# EAGLE design MKRFox1200V2.0 (EAGLE 7.7.0)
Assembly variants: Chip Antenna, Antenna Connector

## Sheet 1 of 2
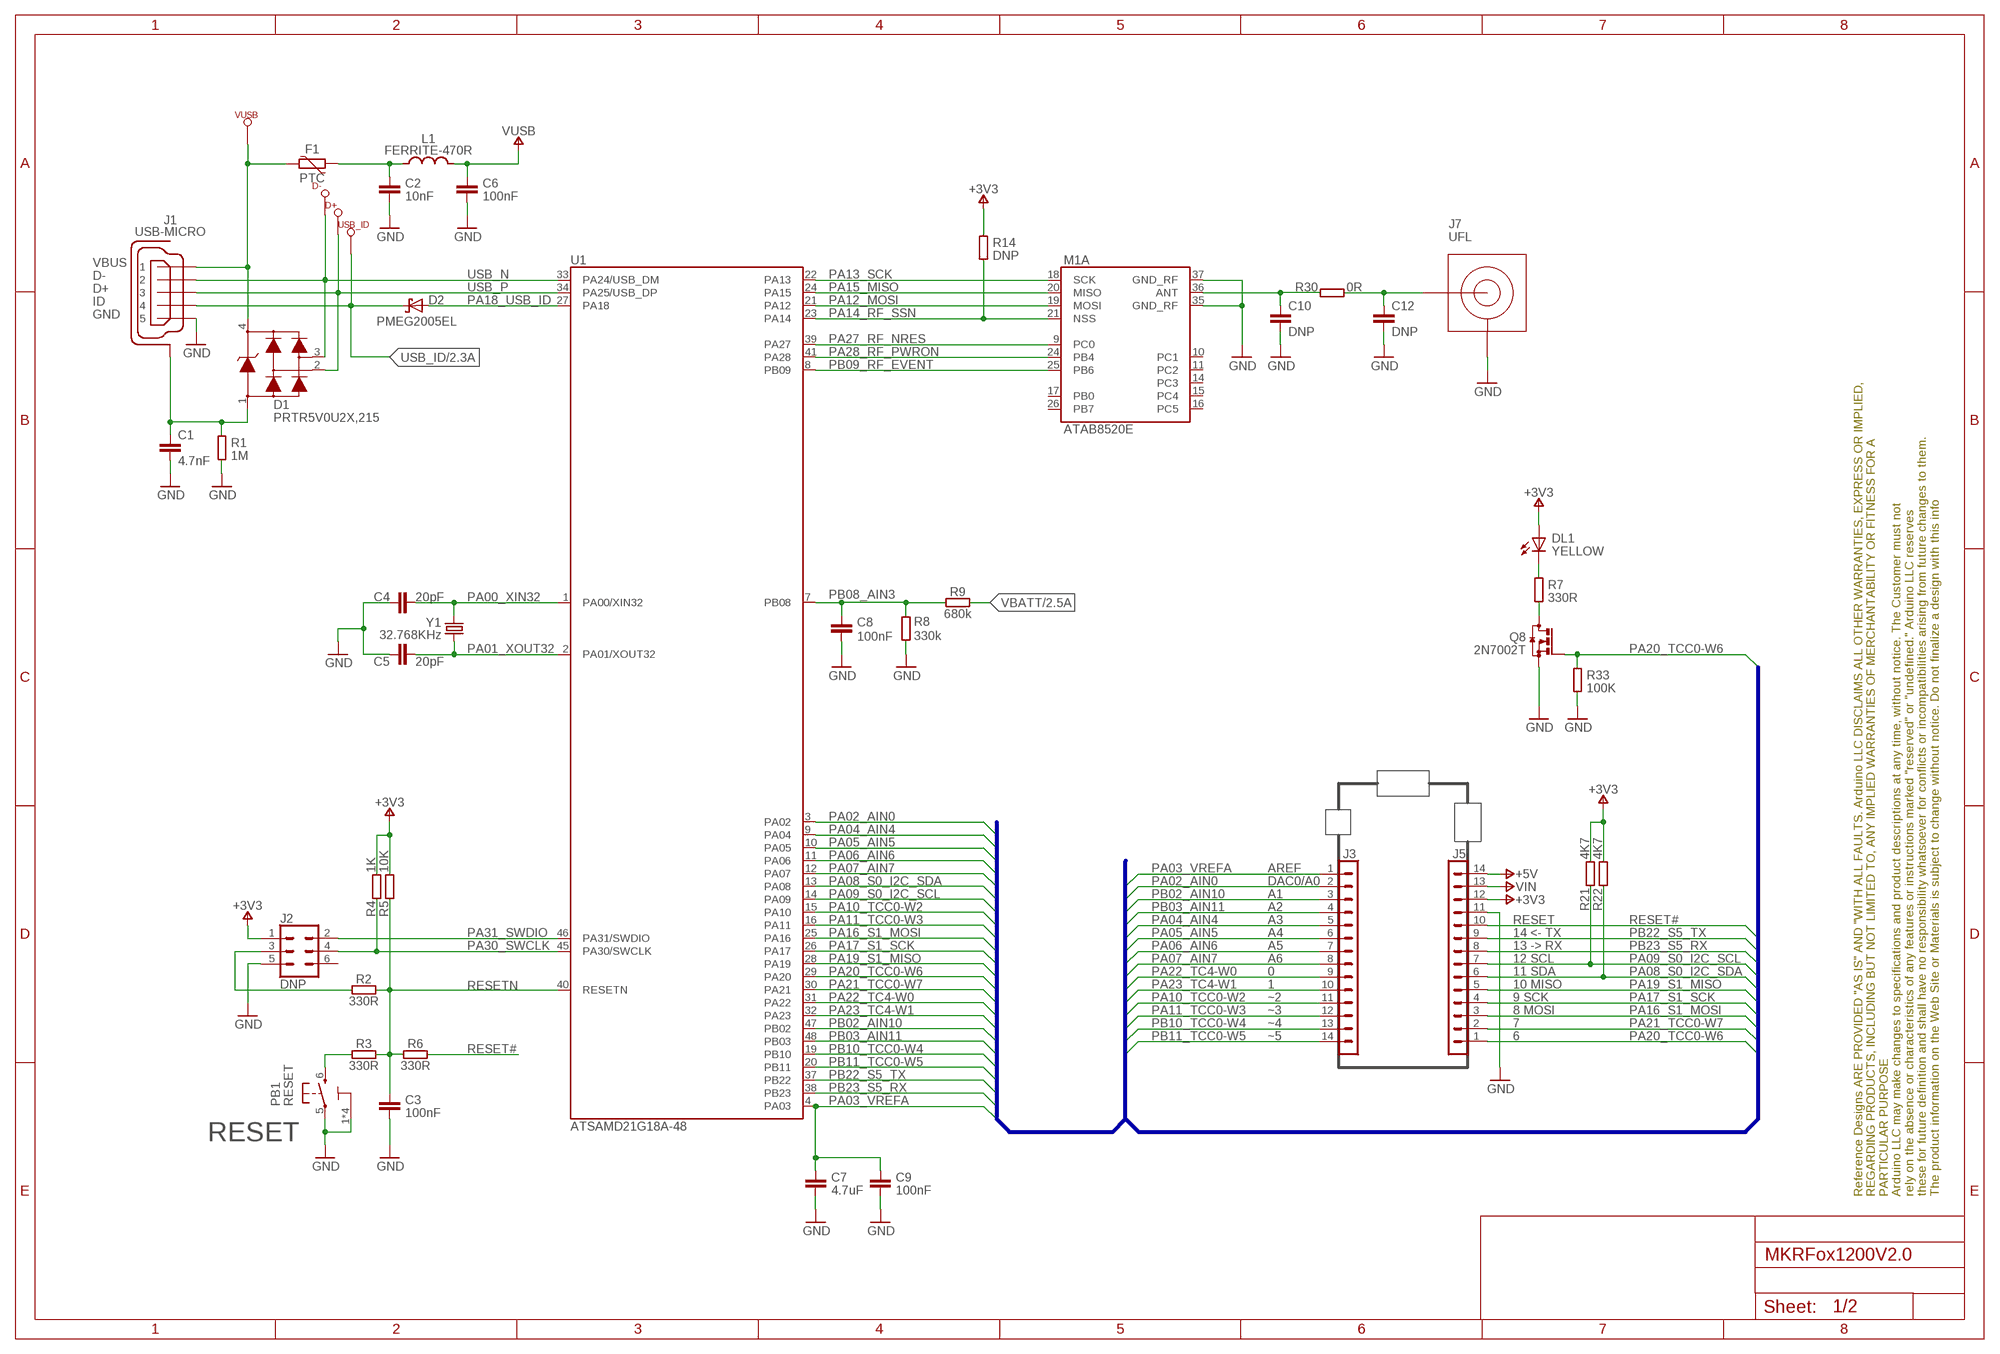
[diagram p0: schematic, sheet 1]

### Parts
C1  4.7nF  C4.7NF-0805  [0805-R2013X50N]
C2  10nF  C-10NF-0402  [0402-1005X55N]
C3  100nF  C-100NF-0402  [0402-1005X55N]
C4  20pF  C-20PF-0402  [0402-1005X55N]
C5  20pF  C-20PF-0402  [0402-1005X55N]
C6  100nF  C-100NF-0402  [0402-1005X55N]
C7  4.7uF  C-4.7UF-0402  [0402-1005X55N]
C8  100nF  C-100NF-0402  [0402-1005X55N]
C9  100nF  C-100NF-0402  [0402-1005X55N]
C10  DNP  CDNP-0402  [0402-1005X55N]
C12  DNP  CDNP-0402  [0402-1005X55N]
D1  PRTR5V0U2X,215  [SOT190P230X110-4N]
D2  PMEG2005EL  [SODFL1008X40N-882D]
D+  TP1.00MM  [TP-1.00MM]
D-  TP1.00MM  [TP-1.00MM]
DL1  YELLOW  LED-YELLOW-0603  [LEDC1608X80N-AK]
F1  PTC  [0603-1608X90N]
FRAME1  Page 1  A3L-LOC  [FRAME]
J1  USB-MICRO  [ZX62-AB-5PA]
J2  DNP  2X3_SMD_MALE  [2X3_SMT]
J3  DNP  PINHD-1X14-SMTH-SMD  [1X14_SMD_TH]
J5  DNP  PINHD-1X14-SMTH-SMD  [1X14_SMD_TH]
J7  UFL  [U.FL-R-SMT-1(60)]
L1  FERRITE-470R  [0603-1608X90N@1]
M1  ATAB8520E  [ATAB8520E]
PB1  RESET  TACTILE1  [C&K_PTS820_NO_HOLES]
Q8  2N7002T  [SOTFL50P160X78-3]
R1  1M  R-1M-0402  [0402-1005X55N]
R2  330R  R-330R-0402  [0402-1005X55N]
R3  330R  R-330R-0402  [0402-1005X55N]
R4  1K  R-10K-0402  [0402-1005X55N]
R5  10K  R-10K-0402  [0402-1005X55N]
R6  330R  R-330R-0402  [0402-1005X55N]
R7  330R  R-330R-0402  [0402-1005X55N]
R8  330k  R-330K-0402  [0402-1005X55N]
R9  680k  R-680K-0402  [0402-1005X55N]
R14  DNP  R-DNP-0402  [0402-1005X55N]
R21  4K7  R-4K7-0402  [0402-1005X55N]
R22  4K7  R-4K7-0402  [0402-1005X55N]
R30  0R  R-0R-0402  [0402-1005X55N]
R33  100K  R-100K-0402  [0402-1005X55N]
U1  ATSAMD21G18A-48  [QFN50P700X700X90-49XN-EPSQ515]
USB_ID  TP1.00MM  [TP-1.00MM]
VUSB  TP1.00MM  [TP-1.00MM]
Y1  32.768KHz  32.768KHZ  [ABS07]

### Nets
+3V3: DL1.A J2.1 J5.12 R4.2 R5.2 R14.2 R21.2 R22.2 ; also sheet 2
+5V: J5.14 ; also sheet 2
GND: C1.2 C2.2 C3.2 C4.1 C5.1 C6.2 C7.2 C8.2 C9.2 C10.2 C12.2 J1.5 J2.5 J5.11 J7.GND1(GND) J7.GND2(GND) M1.35(A:GND_RF) M1.37(A:GND_RF) PB1.1 PB1.2 PB1.3 PB1.4 PB1.5 Q8.S R1.1 R8.1 R33.1 ; also sheet 2
N17650912: D1.4 F1.2 J1.1 VUSB.X(TESTP)
N17658775: PB1.6 R3.1
N$1: C1.1 D1.1 J1.6(SH) J1.7(SH) J1.8(SH) J1.9(SH) J1.10(SH) J1.11(SH) R1.2
N$2: C2.1 F1.1 L1.1
N$3: DL1.C R7.2
N$4: J2.3 R2.1
N$6: Q8.D R7.1
N$17: C12.1 J7.SIG R30.2
N$38: C10.1 M1.36(A:ANT) R30.1
PA00_XIN32: C4.2 U1.1(PA00/XIN32) Y1.2
PA01_XOUT32: C5.2 U1.2(PA01/XOUT32) Y1.1
PA02_AIN0: J3.2 U1.3(PA02)
PA03_VREFA: C7.1 C9.1 J3.1 U1.4(PA03)
PA04_AIN4: J3.5 U1.9(PA04)
PA05_AIN5: J3.6 U1.10(PA05)
PA06_AIN6: J3.7 U1.11(PA06)
PA07_AIN7: J3.8 U1.12(PA07)
PA08_S0_I2C_SDA: J5.6 R22.1 U1.13(PA08)
PA09_S0_I2C_SCL: J5.7 R21.1 U1.14(PA09)
PA10_TCC0-W2: J3.11 U1.15(PA10)
PA11_TCC0-W3: J3.12 U1.16(PA11)
PA12_MOSI: M1.19(A:MOSI) U1.21(PA12)
PA13_SCK: M1.18(A:SCK) U1.22(PA13)
PA14_RF_SSN: M1.21(A:NSS) R14.1 U1.23(PA14)
PA15_MISO: M1.20(A:MISO) U1.24(PA15)
PA16_S1_MOSI: J5.3 U1.25(PA16)
PA17_S1_SCK: J5.4 U1.26(PA17)
PA18_USB_ID: D2.A U1.27(PA18)
PA19_S1_MISO: J5.5 U1.28(PA19)
PA20_TCC0-W6: J5.1 Q8.G R33.2 U1.29(PA20)
PA21_TCC0-W7: J5.2 U1.30(PA21)
PA22_TC4-W0: J3.9 U1.31(PA22)
PA23_TC4-W1: J3.10 U1.32(PA23)
PA27_RF_NRES: M1.9(A:PC0) U1.39(PA27)
PA28_RF_PWRON: M1.24(A:PB4) U1.41(PA28)
PA30_SWCLK: J2.4 R4.1 U1.45(PA30/SWCLK)
PA31_SWDIO: J2.2 U1.46(PA31/SWDIO)
PB02_AIN10: J3.3 U1.47(PB02)
PB03_AIN11: J3.4 U1.48(PB03)
PB08_AIN3: C8.1 R8.2 R9.1 U1.7(PB08)
PB09_RF_EVENT: M1.25(A:PB6) U1.8(PB09)
PB10_TCC0-W4: J3.13 U1.19(PB10)
PB11_TCC0-W5: J3.14 U1.20(PB11)
PB22_S5_TX: J5.9 U1.37(PB22)
PB23_S5_RX: J5.8 U1.38(PB23)
RESET#: J5.10 R6.2
RESETN: C3.1 R2.2 R3.2 R5.1 R6.1 U1.40(RESETN)
USB_ID: D2.C J1.4 USB_ID.X(TESTP) ; also sheet 2
USB_N: D1.3 D-.X(TESTP) J1.2 U1.33(PA24/USB_DM)
USB_P: D1.2 D+.X(TESTP) J1.3 U1.34(PA25/USB_DP)
VBATT: R9.2 ; also sheet 2
VIN: J5.13 ; also sheet 2
VUSB: C6.1 L1.2 ; also sheet 2
Unconnected: J2.6 M1.10(A:PC1) M1.11(A:PC2) M1.14(A:PC3) M1.15(A:PC4) M1.16(A:PC5) M1.17(A:PB0) M1.26(A:PB7)

### Buses
PA03_VREFA,PA02_AIN0,PB02_AIN10,PB03_AIN11,PA04_AIN4,PA05_AIN5,PA06_AIN6,PA07_AIN7,PA22_TC4-W0,PA23_TC4-W1,PA10_TCC0-W2,PA11_TCC0-W3,PB10_TCC0-W4,PB11_TCC0-W5,PA20_TCC0-W6,PA21_TCC0-W7,PA16_S1_MOSI,PA17_S1_SCK,PA19_S1_MISO,PA08_S0_I2C_SDA,PA09_S0_I2C_SCL,PB23_S5_RX,PB22_S5_TX,RESET#

### Notes on the sheet
- AREF
- DAC0/A0
- A1
- A2
- A3 | RESET
- A4 | 14 <- TX
- A5 | 13 -> RX
- A6 | 12 SCL
- 0 | 11 SDA
- 1 | 10 MISO
- ~2 | 9 SCK
- ~3 | 8 MOSI
- ~4 | 7
- ~5 | 6
- RESET

## Sheet 2 of 2
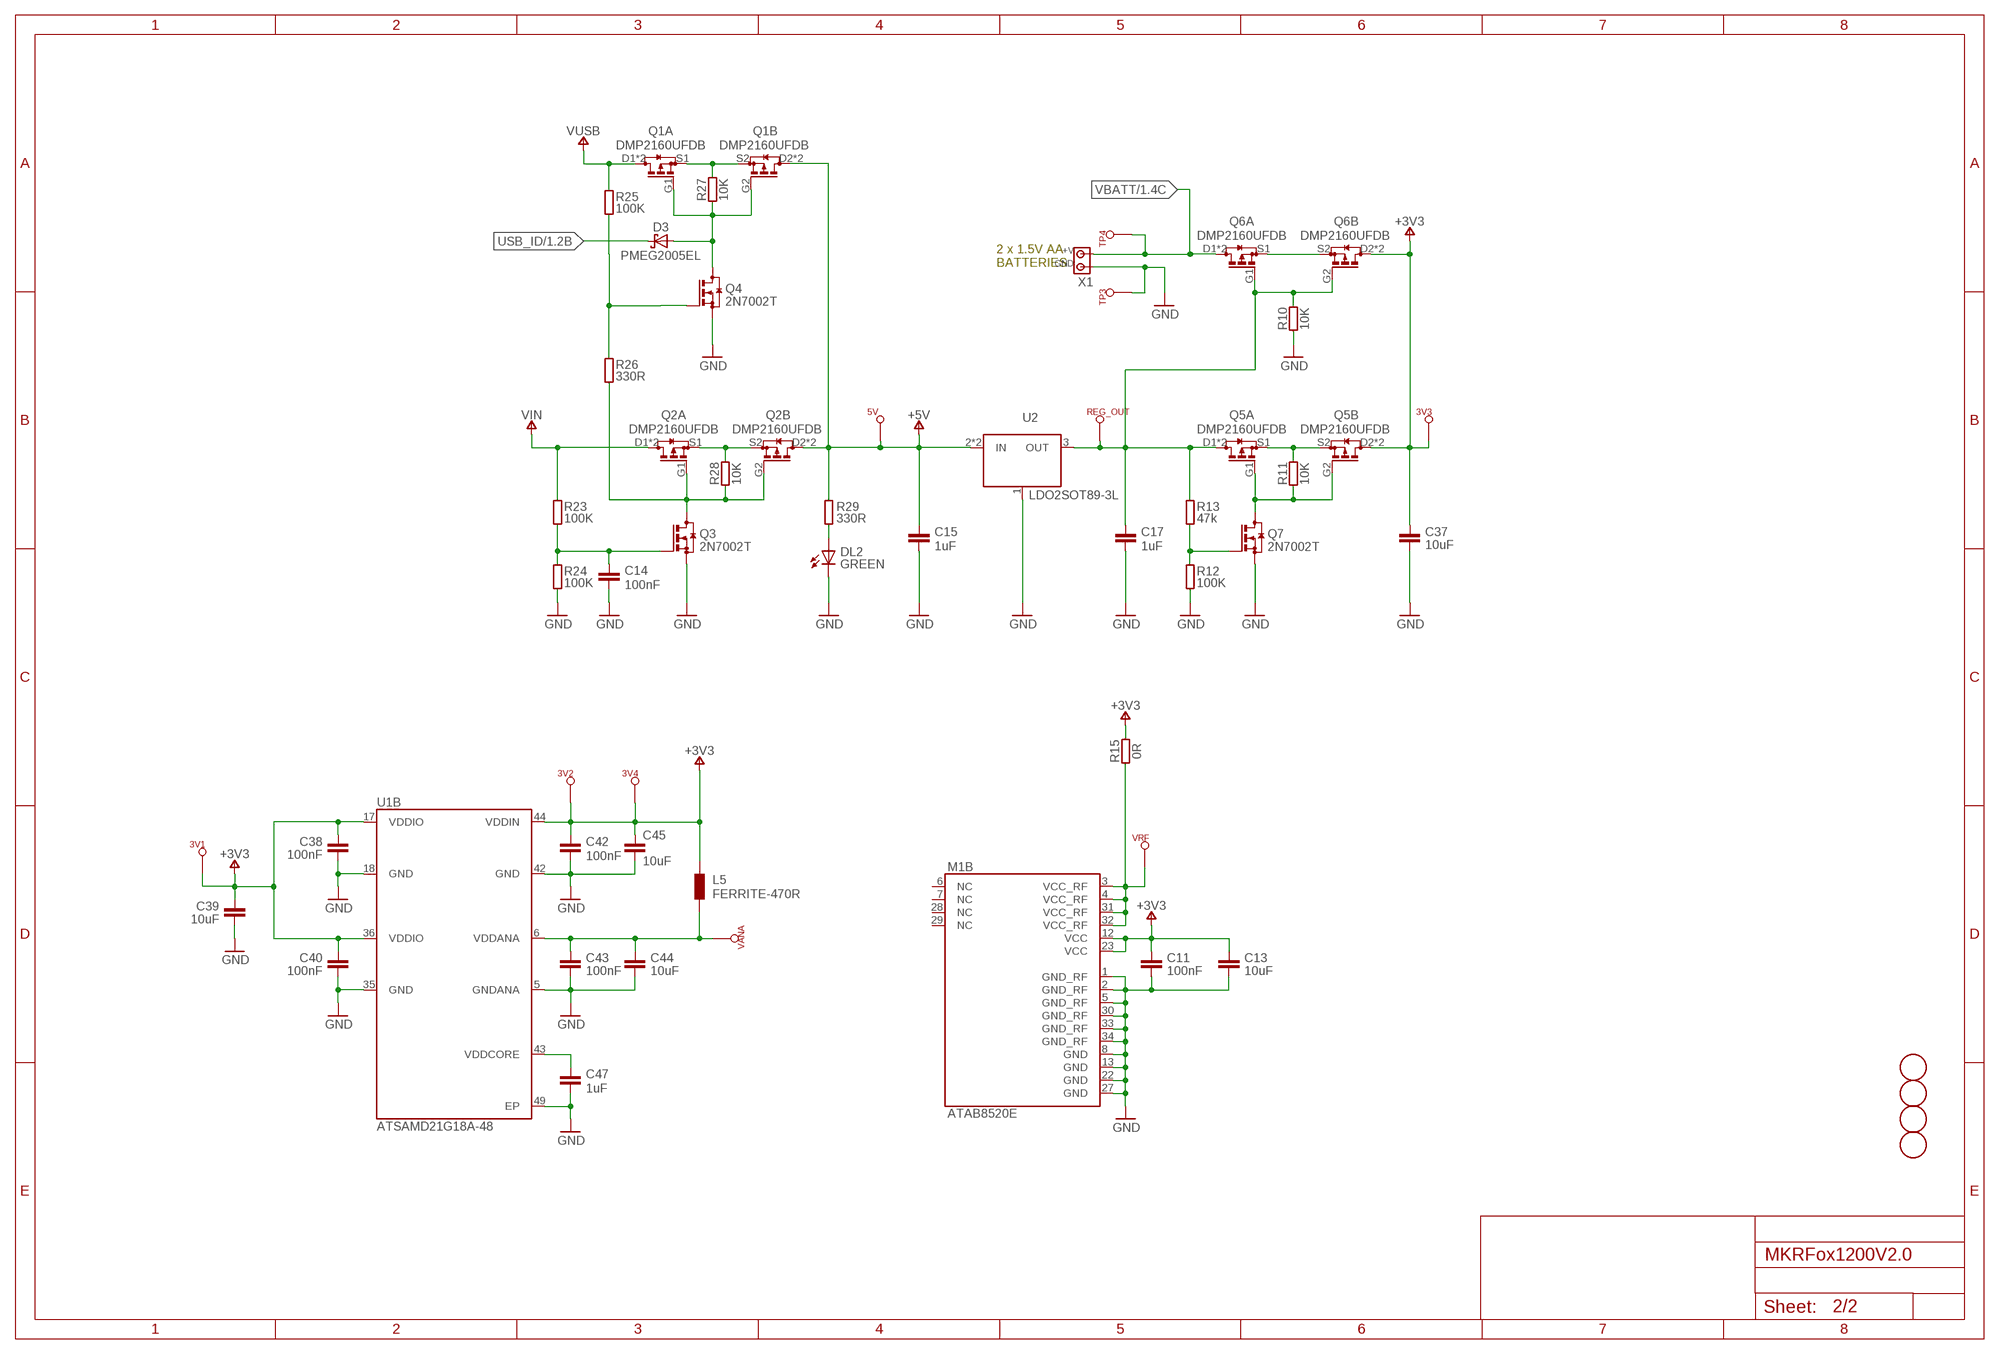
[diagram p1: schematic, sheet 2]

### Parts
3V1  TP0.5MM  [TP-0.50MM]
3V2  TP0.5MM  [TP-0.50MM]
3V3  TP0.5MM  [TP-0.50MM]
3V4  TP0.5MM  [TP-0.50MM]
5V  TP0.5MM  [TP-0.50MM]
C11  100nF  C-100NF-0402  [0402-1005X55N]
C13  10uF  C-10UF-0603  [0603-1608X90N]
C14  100nF  C-100NF-0402  [0402-1005X55N]
C15  1uF  C-1UF-0402  [0402-1005X55N]
C17  1uF  C-1UF-0402  [0402-1005X55N]
C37  10uF  C-10UF-0603  [0603-1608X90N]
C38  100nF  C-100NF-0402  [0402-1005X55N]
C39  10uF  C-10UF-0603  [0603-1608X90N]
C40  100nF  C-100NF-0402  [0402-1005X55N]
C42  100nF  C-100NF-0402  [0402-1005X55N]
C43  100nF  C-100NF-0402  [0402-1005X55N]
C44  10uF  C-10UF-0603  [0603-1608X90N]
C45  10uF  C-10UF-0603  [0603-1608X90N]
C47  1uF  C-1UF-0402  [0402-1005X55N]
D3  PMEG2005EL  [SODFL1008X40N-882D]
DL2  GREEN  LED-GREEN-0603  [LEDC1608X80N-AK]
FD1  FIDUCIAL-1.5MM  [FD-1-1.5]
FD2  FIDUCIAL-1.5MM  [FD-1-1.5]
FD3  FIDUCIAL-1.5MM  [FD-1-1.5]
FD4  FIDUCIAL-1.5MM  [FD-1-1.5]
L5  FERRITE-470R  [0603-1608X90N@1]
Q1  DMP2160UFDB  [PWR_SC70]
Q2  DMP2160UFDB  [PWR_SC70]
Q3  2N7002T  [SOTFL50P160X78-3]
Q4  2N7002T  [SOTFL50P160X78-3]
Q5  DMP2160UFDB  [PWR_SC70]
Q6  DMP2160UFDB  [PWR_SC70]
Q7  2N7002T  [SOTFL50P160X78-3]
R10  10K  R-10K-0402  [0402-1005X55N]
R11  10K  R-10K-0402  [0402-1005X55N]
R12  100K  R-100K-0402  [0402-1005X55N]
R13  47k  R-47K-0402  [0402-1005X55N]
R15  0R  R-0R-0402  [0402-1005X55N]
R23  100K  R-100K-0402  [0402-1005X55N]
R24  100K  R-100K-0402  [0402-1005X55N]
R25  100K  R-100K-0402  [0402-1005X55N]
R26  330R  R-330R-0402  [0402-1005X55N]
R27  10K  R-10K-0402  [0402-1005X55N]
R28  10K  R-10K-0402  [0402-1005X55N]
R29  330R  R-330R-0402  [0402-1005X55N]
REG_OUT  TP0.5MM  [TP-0.50MM]
TP3  TP1.00MM  [TP-1.00MM]
TP4  TP1.00MM  [TP-1.00MM]
U2  LDO2SOT89-3L  [SOT89-3L]
VANA  TP0.5MM  [TP-0.50MM]
VRF  TP0.5MM  [TP-0.50MM]
X1  SCREW2X2.54  [SCREW2]

### Nets
+3V3: 3V1.X(TESTP) 3V2.X(TESTP) 3V3.X(TESTP) 3V4.X(TESTP) C11.1 C13.1 C37.1 C38.1 C39.1 C40.1 C42.1 C45.1 L5.1 M1.12(B:VCC) M1.23(B:VCC) Q5.D2'(B:D) Q5.D2(B:D) Q6.D2'(B:D) Q6.D2(B:D) R15.2 U1.17(VDDIO) U1.36(VDDIO) U1.44(VDDIN) ; also sheet 1
+5V: 5V.X(TESTP) C15.1 Q1.D2'(B:D) Q1.D2(B:D) Q2.D2'(B:D) Q2.D2(B:D) R29.2 U2.2(IN) U2.TH(IN) ; also sheet 1
GND: C11.2 C13.2 C14.2 C15.2 C17.2 C37.2 C38.2 C39.2 C40.2 C42.2 C43.2 C44.2 C45.2 C47.2 DL2.C M1.1(B:GND_RF) M1.2(B:GND_RF) M1.5(B:GND_RF) M1.8(B:GND) M1.13(B:GND) M1.22(B:GND) M1.27(B:GND) M1.30(B:GND_RF) M1.33(B:GND_RF) M1.34(B:GND_RF) Q3.S Q4.S Q7.S R10.1 R12.1 R24.1 TP3.X(TESTP) U1.5(GNDANA) U1.18(GND) U1.35(GND) U1.42(GND) U1.49(EP) U2.1(GND/ADJ) X1.GND ; also sheet 1
N1: Q5.S1(A:S) Q5.S2(B:S) R11.2
N2: Q5.G1(A:G) Q5.G2(B:G) Q7.D R11.1
N3: Q7.G R12.2 R13.1
N17690335: Q1.S1(A:S) Q1.S2(B:S) R27.2
N17690346: D3.A Q1.G1(A:G) Q1.G2(B:G) Q4.D R27.1
N17690381: Q4.G R25.1 R26.2
N17690821: Q2.S1(A:S) Q2.S2(B:S) R28.2
N17690840: Q2.G1(A:G) Q2.G2(B:G) Q3.D R26.1 R28.1
N17690878: C14.1 Q3.G R23.1 R24.2
N17834267: DL2.A R29.1
N17852357: C43.1 C44.1 L5.2 U1.6(VDDANA) VANA.X(TESTP)
N$7: M1.3(B:VCC_RF) M1.4(B:VCC_RF) M1.31(B:VCC_RF) M1.32(B:VCC_RF) R15.1 VRF.X(TESTP)
N$8: C17.1 Q5.D1'(A:D) Q5.D1(A:D) Q6.G1(A:G) Q6.G2(B:G) R10.2 R13.2 REG_OUT.X(TESTP) U2.3(OUT)
N$12: Q6.S1(A:S) Q6.S2(B:S)
N$46: C47.1 U1.43(VDDCORE)
USB_ID: D3.C ; also sheet 1
VBATT: Q6.D1'(A:D) Q6.D1(A:D) TP4.X(TESTP) X1.V+ ; also sheet 1
VIN: Q2.D1'(A:D) Q2.D1(A:D) R23.2 ; also sheet 1
VUSB: Q1.D1'(A:D) Q1.D1(A:D) R25.2 ; also sheet 1
Unconnected: M1.6(B:NC) M1.7(B:NC) M1.28(B:NC) M1.29(B:NC)

### Notes on the sheet
- 2 x 1.5V AA
  BATTERIES

## Library data of the parts
3V1-3V4 5V D+ D- REG_OUT TP3 TP4 USB_ID VANA VRF VUSB = Arduino-utility:TP
C1 = Arduino-rcl:C: SMD Capacitor; DATASHEET: http://www.kemet.com/Lists/ProductCatalog/Attachments/40/KEM_C1010_X7R_HV_SMD.pdf; DISTRIBUTOR-LINK: www.kemet.com/docfinder?Partnumber=C0805C472KDRACTU; DISTRIBUTOR-PN: 399-6738-1-ND; MANUFACTURER: Kemet; MANUFACTURER-PN: C0805C472KDRACTU
C2 = Arduino-rcl:C: SMD Capacitor; DATASHEET: http://search.murata.co.jp/Ceramy/image/img/A01X/partnumbering_e_01.pdf; DISTRIBUTOR-LINK: http://www.digikey.com/product-detail/en/murata-electronics-north-america/GRM155R71H103KA88J/490-6351-1-ND/3845548; DISTRIBUTOR-PN: 490-6351-1-ND; MANUFACTURER: Murata; MANUFACTURER-PN: GRM155R71H103KA88J
C3 C6 C8 C9 C11 C14 C38 C40 C42 C43 = Arduino-rcl:C: SMD Capacitor; DATASHEET: http://www.tdk.com/pdf/TDKMLCCCapRange.pdf; DISTRIBUTOR-LINK: http://www.digikey.com/product-detail/en/tdk-corporation/C1005X5R1H104K050BB/445-5942-1-ND/2443982; DISTRIBUTOR-PN: 445-5942-1-ND; MANUFACTURER: TDK; MANUFACTURER-PN: C1005X5R1H104K050BB
C4 C5 = Arduino-rcl:C: SMD Capacitor; DATASHEET: http://www.kemet.com/docfinder?Partnumber=CBR04C200J5GAC; DISTRIBUTOR-LINK: http://www.digikey.com/product-detail/en/kemet/CBR04C200J5GAC/399-6173-1-ND/2732143; DISTRIBUTOR-PN: 399-6173-1-ND; MANUFACTURER: Kemet; MANUFACTURER-PN: CBR04C200J5GAC
C7 = Arduino-rcl:C: SMD Capacitor; DATASHEET: http://search.murata.co.jp/Ceramy/image/img/A01X/partnumbering_e_01.pdf; DISTRIBUTOR-LINK: http://www.digikey.com/product-detail/en/murata-electronics-north-america/GRM155R60J475ME47D/490-5915-1-ND/3719860; DISTRIBUTOR-PN: 490-5915-1-ND; MANUFACTURER: Murata; MANUFACTURER-PN: GRM155R60J475ME47D
C10 C12 = Arduino-rcl:C: SMD Capacitor; DATASHEET: DNP; DISTRIBUTOR-LINK: DNP; DISTRIBUTOR-PN: DNP; MANUFACTURER: DNP; MANUFACTURER-PN: DNP
C13 C37 C39 C44 C45 = Arduino-rcl:C: SMD Capacitor; DATASHEET: http://www.murata.com/~/media/webrenewal/support/library/catalog/products/capacitor/mlcc/c02e.pdf; DISTRIBUTOR-LINK: http://www.digikey.com/product-search/en?keywords=490-10728-1-ND; DISTRIBUTOR-PN: 490-10728-1-ND; MANUFACTURER: Murata; MANUFACTURER-PN: GRM188R61C106KAALD
C15 C17 C47 = Arduino-rcl:C: SMD Capacitor; DATASHEET: http://search.murata.co.jp/Ceramy/image/img/A01X/partnumbering_e_01.pdf; DISTRIBUTOR-LINK: http://www.digikey.com/product-detail/en/murata-electronics-north-america/GRM155R61E105KA12D/490-10017-1-ND/5026367; DISTRIBUTOR-PN: 490-10017-1-ND; MANUFACTURER: Murata; MANUFACTURER-PN: GRM155R61E105KA12D
D1 = Arduino-diodes:PRTR5V0U2X,215: USB ESD protection; DATASHEET: http://www.nxp.com/documents/data_sheet/PRTR5V0U2X.pdf; DISTRIBUTOR-LINK: http://www.digikey.com/product-detail/en/nxp-semiconductors/PRTR5V0U2X,215/568-4140-1-ND/1589981; DISTRIBUTOR-PN: 568-4140-1-ND; MANUFACTURER: NXP; MANUFACTURER-PN: PRTR5V0U2X,215
D2 D3 = Arduino-diodes:PMEG2005EL: DIODE SCHOTTKY 20V 500MA SOD882; DATASHEET: http://www.nxp.com/documents/data_sheet/PMEG2005EL.pdf; DISTRIBUTOR-LINK: http://www.digikey.com/product-detail/en/nxp-semiconductors/PMEG2005EL,315/568-6754-1-ND/2676794; DISTRIBUTOR-PN: 568-6754-1-ND; MANUFACTURER: NXP; MANUFACTURER-PN: PMEG2005EL,315
DL1 = Arduino-diodes:LED: LED; DATASHEET: http://media.digikey.com/pdf/Data%20Sheets/Avago%20PDFs/HSMz-Czzz.pdf; DISTRIBUTOR-LINK: http://www.digikey.com/product-detail/en/broadcom-limited/HSMY-C190/516-1424-1-ND/637748; DISTRIBUTOR-PN: 516-1424-1-ND; MANUFACTURER: Avago; MANUFACTURER-PN: HSMY-C190
DL2 = Arduino-diodes:LED: LED; DATASHEET: http://media.digikey.com/pdf/Data%20Sheets/Avago%20PDFs/HSMz-Czzz.pdf; DISTRIBUTOR-LINK: http://www.digikey.com/product-detail/en/broadcom-limited/HSMG-C190/516-1425-1-ND/637749; DISTRIBUTOR-PN: 516-1425-1-ND; MANUFACTURER: Avago; MANUFACTURER-PN: HSMG-C190
F1 = Arduino-rcl:PTC: SMD PTC; DATASHEET: http://www.bourns.com/docs/Product-Datasheets/mffsmf.pdf; DISTRIBUTOR-LINK: http://www.digikey.com/product-detail/en/bourns-inc/MF-FSMF050X-2/MF-FSMF050X-2CT-ND/2039389; DISTRIBUTOR-PN: MF-FSMF050X-2CT-ND; MANUFACTURER: Bourns Inc; MANUFACTURER-PN: MF-FSMF050X-2
FD1-FD4 = Arduino-utility:FIDUCIAL: Fiducial mount; DATASHEET: DNP; DISTRIBUTOR-LINK: DNP; DISTRIBUTOR-PN: DNP; MANUFACTURER: DNP; MANUFACTURER-PN: DNP
FRAME1 = Arduino-utility:A3L-LOC: FRAME DIN A3, landscape with location and doc. field
J1 = Arduino-connectors:USB-MICRO: USB - micro AB USB 2.0 Receptacle Connector 5 Position Surface Mount, Right Angle, Horizontal; DATASHEET: https://www.hirose.com/product/en/download_file/key_name/ZX/category/Catalog/doc_file_id/31704/?file_category_id=4&item_id=13&is_series=1; DISTRIBUTOR-LINK: http://www.digikey.com/product-detail/en/hirose-electric-co-ltd/ZX62-AB-5PA(31)/H125279CT-ND/5994741; DISTRIBUTOR-PN: H125279CT-ND; MANUFACTURER: Hirose; MANUFACTURER-PN: ZX62-AB-5PA(31)
J2 = Arduino-connectors:2X3_SMD_MALE: SMD connector; DATASHEET: DNP; DISTRIBUTOR-LINK: DNP; DISTRIBUTOR-PN: DNP; MANUFACTURER: DNP; MANUFACTURER-PN: DNP
J3 J5 = Arduino-connectors:PINHD-1X14-SM: PIN HEADER; DATASHEET: -; DISTRIBUTOR-LINK: -; DISTRIBUTOR-PN: -; MANUFACTURER: ELDECO; MANUFACTURER-PN: FH254114DF08500T
J7 = Arduino-connectors:UFL: U.FL, Ultra Miniature Coaxial Connector Receptacle, Male Pin 50 Ohm Surface Mount Solder; DATASHEET: http://media.digikey.com/pdf/Data%20Sheets/Hirose%20PDFs/UFL%20Series.pdf; DISTRIBUTOR-LINK: http://www.digikey.com/product-search/en?keywords=U.FL-R-SMT-1(60); DISTRIBUTOR-PN: U.FL-R-SMT-1(60)-ND; MANUFACTURER: Hirose; MANUFACTURER-PN: U.FL-R-SMT-1(60)
L1 = Arduino-rcl:FERRITE-470R: FERRITE BEAD 470 OHM 0603 1LN; DATASHEET: http://search.murata.co.jp/Ceramy/image/img/PDF/ENG/L0110S0100BLM18P.pdf; DISTRIBUTOR-LINK: http://www.digikey.com/product-detail/en/murata-electronics-north-america/BLM18PG471SN1D/490-5223-1-ND/1948399; DISTRIBUTOR-PN: 490-5223-1-ND; MANUFACTURER: Murata; MANUFACTURER-PN: BLM18PG471SN1D
L5 = Arduino-rcl:FERRITE: FERRITE BEAD 470 OHM 0603 1LN; DATASHEET: http://search.murata.co.jp/Ceramy/image/img/PDF/ENG/L0110S0100BLM18P.pdf; DISTRIBUTOR-LINK: http://www.digikey.com/product-detail/en/murata-electronics-north-america/BLM18PG471SN1D/490-5223-1-ND/1948399; DISTRIBUTOR-PN: 490-5223-1-ND; MANUFACTURER: Murata; MANUFACTURER-PN: BLM18PG471SN1D
M1 = Arduino-ucs&SoCs:ATAB8520E: Sigfox Module; DATASHEET: -; DISTRIBUTOR-LINK: -; DISTRIBUTOR-PN: -; MANUFACTURER: Atmel; MANUFACTURER-PN: ATAB8520E
PB1 = Arduino-pushbuttons:TACTILE1: Tactile Switch SPST-NO Top Actuated Surface Mount; DATASHEET: http://www.ckswitches.com/media/1474/pts820.pdf; DISTRIBUTOR-LINK: http://www.digikey.com/product-detail/en/c-k-components/PTS820%20J25K%20SMTR%20LFS/PTS820%20J25K%20SMTR%20LFS-ND/4142165; DISTRIBUTOR-PN: PTS820 J25K SMTR LFS-ND; MANUFACTURER: C&K; MANUFACTURER-PN: PTS820 J25K SMTR LFS
Q1 Q2 Q5 Q6 = Arduino-transistors:DMP2160UFDB: MOSFET 2P-CH 20V 3.8A 6UDFN; DATASHEET: http://www.diodes.com/_files/datasheets/ds31643.pdf; DISTRIBUTOR-LINK: http://www.digikey.com/product-detail/en/diodes-incorporated/DMP2160UFDB-7/DMP2160UFDB-7DI-ND/4249940; DISTRIBUTOR-PN: DMP2160UFDB-7DI-ND; MANUFACTURER: Diodes Inc; MANUFACTURER-PN: DMP2160UFDB-7
Q3 Q4 Q7 Q8 = Arduino-transistors:2N7002T: MOSFET N-CH 60V 115MA SOT-523; DATASHEET: http://www.diodes.com/_files/datasheets/ds30301.pdf; DISTRIBUTOR-LINK: http://www.digikey.com/product-detail/en/diodes-incorporated/2N7002T-7-F/2N7002T-FDICT-ND/815290; DISTRIBUTOR-PN: 2N7002T-FDICT-ND; MANUFACTURER: Diodes Incorporated; MANUFACTURER-PN: 2N7002T-7-F
R1 = Arduino-rcl:R: SMD Resistor; DATASHEET: www.yageo.com.tw/exep/pages/download/literatures/PYu-R_INT-thick_7.pdf; DISTRIBUTOR-LINK: http://www.digikey.com/product-detail/en/yageo/RC0402JR-07330RL/311-330JRCT-ND/729412; DISTRIBUTOR-PN: 311-330JRCT-ND; MANUFACTURER: Yageo; MANUFACTURER-PN: RC0402JR-07330RL
R2 R3 R6 R7 R26 R29 = Arduino-rcl:R: SMD Resistor; DATASHEET: www.yageo.com.tw/exep/pages/download/literatures/PYu-R_INT-thick_7.pdf; DISTRIBUTOR-LINK: http://www.digikey.com/product-detail/en/yageo/RC0402FR-07330RL/311-330LRCT-ND/729541; DISTRIBUTOR-PN: 311-330LRCT-ND; MANUFACTURER: Yageo; MANUFACTURER-PN: RC0402FR-07330RL
R4 R5 R10 R11 R27 R28 = Arduino-rcl:R: SMD Resistor; DATASHEET: www.yageo.com.tw/exep/pages/download/literatures/PYu-R_INT-thick_7.pdf; DISTRIBUTOR-LINK: http://www.digikey.com/product-detail/en/yageo/RC0402FR-0710KL/311-10.0KLRCT-ND/729470; DISTRIBUTOR-PN: 311-10.0KLRCT-ND; MANUFACTURER: Yageo; MANUFACTURER-PN: RC0402FR-0710KL
R8 = Arduino-rcl:R: SMD Resistor; DATASHEET: www.yageo.com.tw/exep/pages/download/literatures/PYu-R_INT-thick_7.pdf; DISTRIBUTOR-LINK: http://www.digikey.com/product-detail/en/yageo/RC0402JR-07330KL/311-330KJRCT-ND/729413; DISTRIBUTOR-PN: 311-330KJRCT-ND; MANUFACTURER: Yageo; MANUFACTURER-PN: RC0402JR-07330KL
R9 = Arduino-rcl:R: SMD Resistor; DATASHEET: www.yageo.com.tw/exep/pages/download/literatures/PYu-R_INT-thick_7.pdf; DISTRIBUTOR-LINK: http://www.digikey.it/product-detail/it/yageo/RC0402JR-07680KL/311-680KJRTR-ND/726501; DISTRIBUTOR-PN: 311-680KJRTR-ND; MANUFACTURER: Yageo; MANUFACTURER-PN: RC0402JR-07680KL
R12 R23-R25 R33 = Arduino-rcl:R: SMD Resistor; DATASHEET: www.yageo.com.tw/exep/pages/download/literatures/PYu-R_INT-thick_7.pdf; DISTRIBUTOR-LINK: http://www.digikey.com/product-detail/en/yageo/RC0402FR-07100KL/311-100KLRCT-ND/729473; DISTRIBUTOR-PN: 311-100KLRCT-ND; MANUFACTURER: Yageo; MANUFACTURER-PN: RC0402FR-07100KL
R13 = Arduino-rcl:R: SMD Resistor; DATASHEET: www.yageo.com.tw/exep/pages/download/literatures/PYu-R_INT-thick_7.pdf; DISTRIBUTOR-LINK: http://www.digikey.com/product-detail/en/yageo/RC0402JR-0747KL/311-47KJRCT-ND/729432; DISTRIBUTOR-PN: 311-47KJRCT-ND; MANUFACTURER: Yageo; MANUFACTURER-PN: RC0402JR-0747KL
R14 = Arduino-rcl:R: SMD Resistor; DATASHEET: DNP; DISTRIBUTOR-LINK: DNP; DISTRIBUTOR-PN: DNP; MANUFACTURER: DNP; MANUFACTURER-PN: DNP
R15 R30 = Arduino-rcl:R: SMD Resistor; DATASHEET: www.yageo.com.tw/exep/pages/download/literatures/PYu-R_INT-thick_7.pdf; DISTRIBUTOR-LINK: http://www.digikey.com/product-detail/en/yageo/RC0402FR-070RL/311-0.0LRCT-ND/2827888; DISTRIBUTOR-PN: 311-0.0LRCT-ND; MANUFACTURER: Yageo; MANUFACTURER-PN: RC0402FR-070RL
R21 R22 = Arduino-rcl:R: SMD Resistor; DATASHEET: www.yageo.com.tw/exep/pages/download/literatures/PYu-R_INT-thick_7.pdf; DISTRIBUTOR-LINK: http://www.digikey.com/product-detail/en/yageo/RC0402FR-074K7L/311-4.7KLRCT-ND/2827881; DISTRIBUTOR-PN: 311-4.7KLRCT-ND; MANUFACTURER: Yageo; MANUFACTURER-PN: RC0402FR-074K7L
U1 = Arduino-ucs&SoCs:ATSAMD21G18A-48: ARM® Cortex®-M0+ SAM D21G Microcontroller IC 32-Bit 48MHz 256KB (256K x 8) FLASH 48-TQFP (7x7); DATASHEET: http://www.atmel.com/Images/Atmel-42181-SAM-D21_Datasheet.pdf; DISTRIBUTOR-LINK: http://www.digikey.com/product-detail/en/atmel/ATSAMD21G18A-AUT/ATSAMD21G18A-AUTCT-ND/4878879; DISTRIBUTOR-PN: ATSAMD21G18A-AUTCT-ND; MANUFACTURER: Atmel; MANUFACTURER-PN: ATSAMD21G18A-MU
U2 = Arduino-ICs:LDO2; DATASHEET: http://www.diodes.com/_files/datasheets/AP7215.pdf; DISTRIBUTOR-LINK: http://www.digikey.com/product-detail/en/diodes-incorporated/AP7215-33YG-13/AP7215-33YG-13DICT-ND/2179740; DISTRIBUTOR-PN: AP7215-33YG-13DICT-ND; MANUFACTURER: Diodes Inc; MANUFACTURER-PN: AP7215-33YG-13
X1 = Arduino-connectors:SCREW2X2.54: 2.45 Screw terminal Block; DATASHEET: http://www.on-shore.com/wp-content/uploads/2015/09/ostvnxxa150.pdf; DISTRIBUTOR-LINK: http://www.digikey.com/product-detail/en/on-shore-technology-inc/OSTVN02A150/ED10561-ND/1588862; DISTRIBUTOR-PN: ED10561-ND; MANUFACTURER: On Shore Technology Inc.; MANUFACTURER-PN: OSTVN02A150
Y1 = Arduino-crystals:32.768KHZ: LF crystal; DATASHEET: http://www.abracon.com/Resonators/ABS07.pdf; DISTRIBUTOR-LINK: http://www.digikey.com/product-detail/en/abracon-llc/ABS07-32.768KHZ-T/535-9542-1-ND/1237009; DISTRIBUTOR-PN: 535-9542-1-ND; MANUFACTURER: Abracon LLC; MANUFACTURER-PN: ABS07-32.768KHZ-T

## Net classes
0 default: width 0.25 mm, drill 0.195 mm

## Board
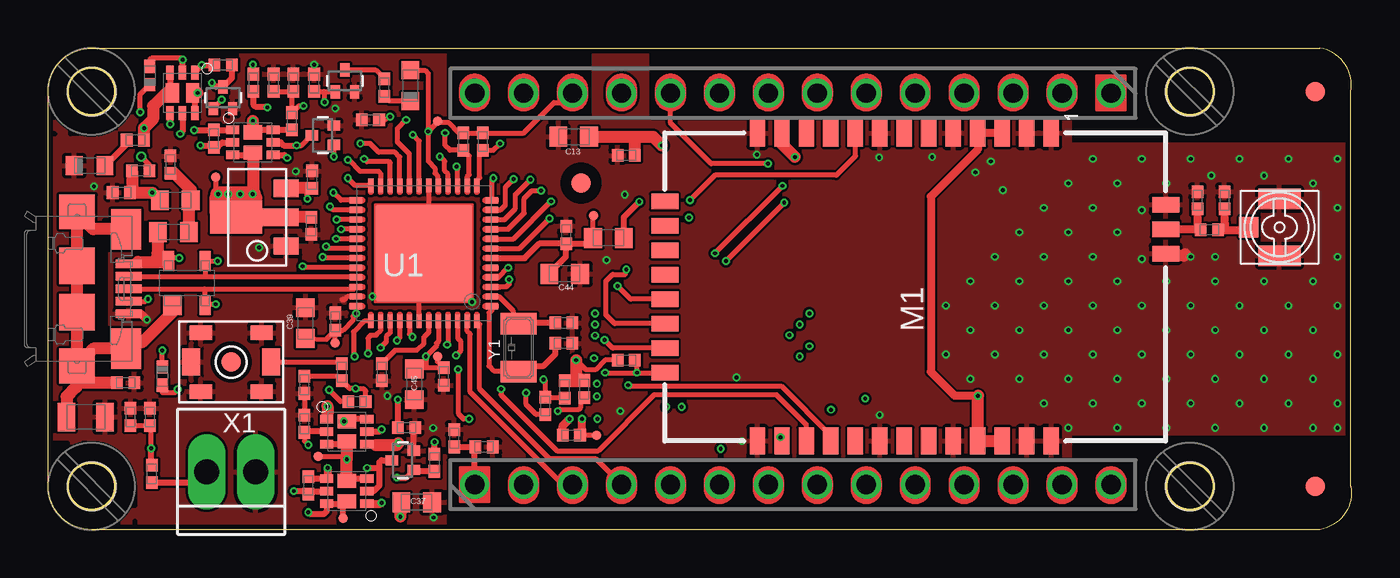
[diagram p2: board, top side]
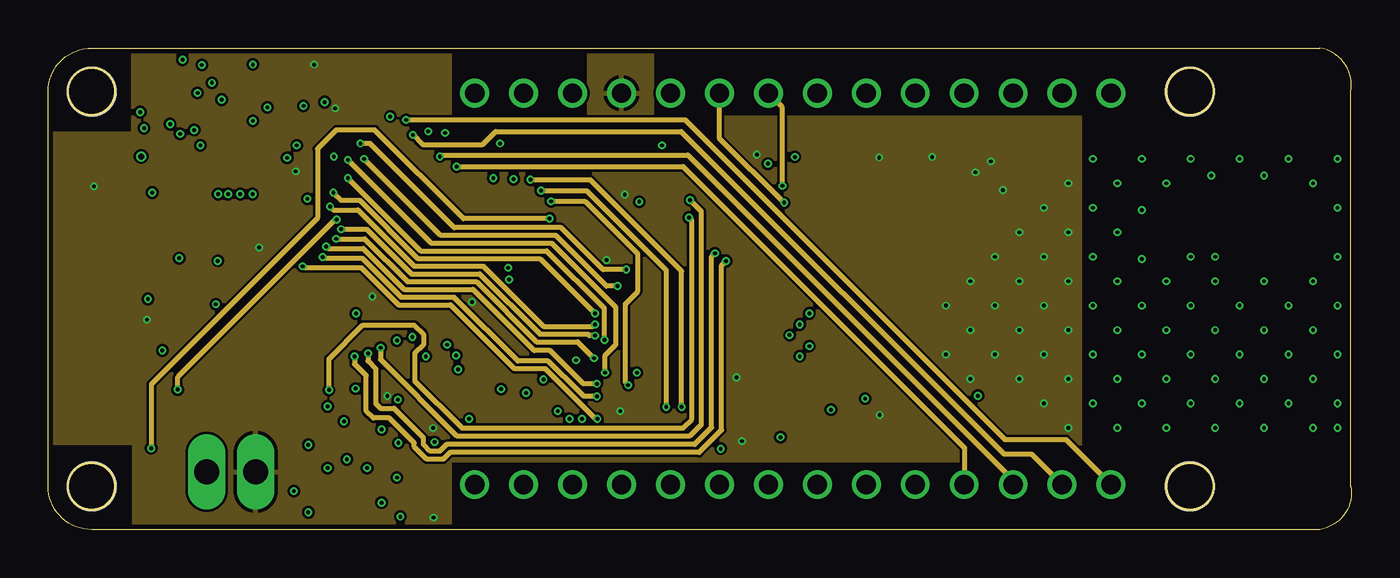
[diagram p3: board, inner layer LFSignals]
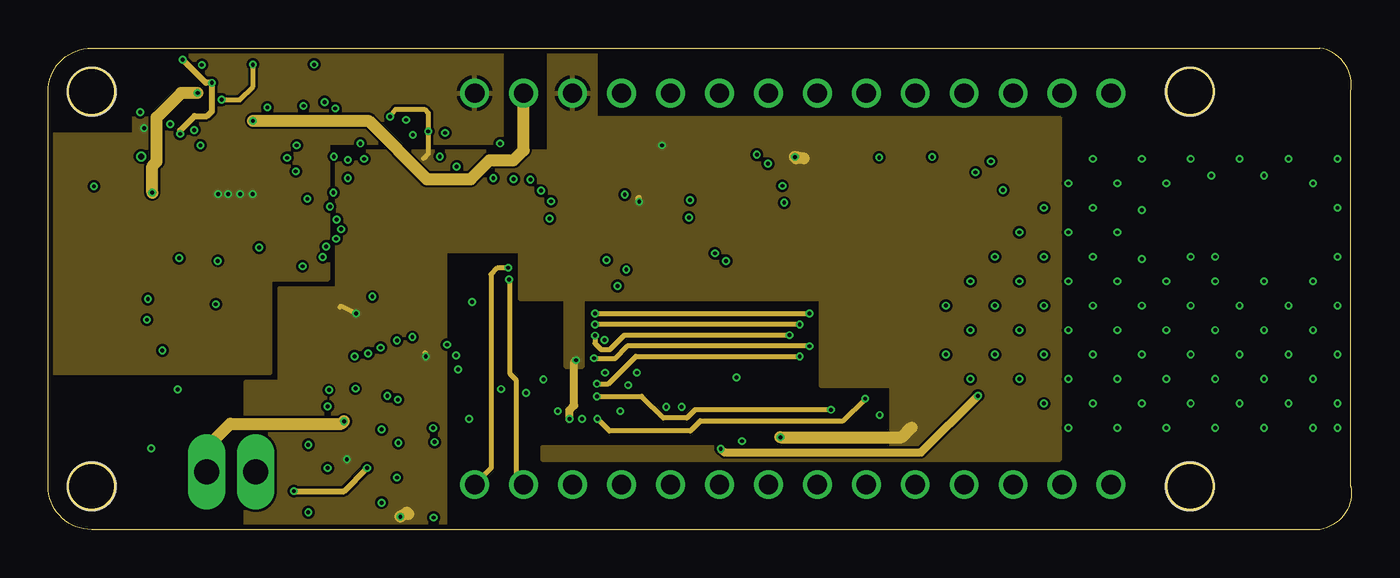
[diagram p4: board, inner layer POWER]
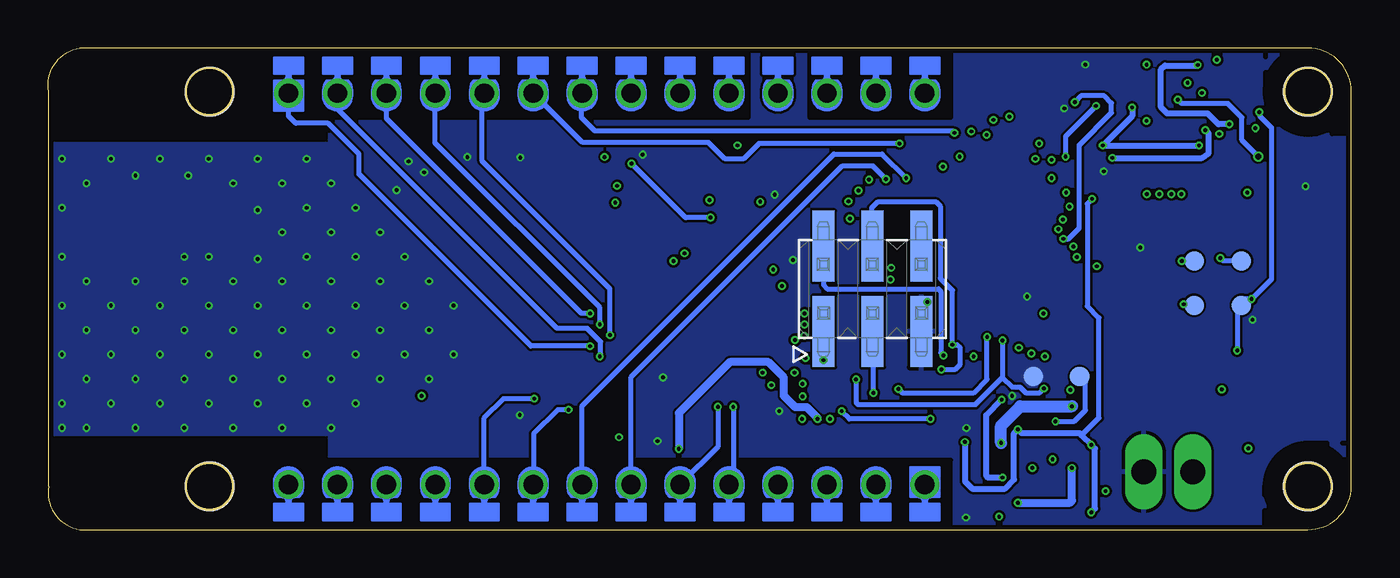
[diagram p5: board, bottom side, seen from below]

Size 67.63 x 25 mm. Coordinates in mm from the lower left corner, seen from the top.
Outline: 66,0 2.25,0 arc-90 0,2.25 0,22.75 arc-90 2.25,25 66,25 arc-90 67.6,22.75 67.6,2.25 arc-90 66,0
Copper layers (1*2*15*16): Top 0.035mm / dielectric 0.2mm / LFSignals 0.0175mm / dielectric 0.3mm / POWER 0.0175mm / dielectric 0.2mm / Bottom 0.035mm
Design rules "B&B_4layers *": minimum track width 8mil, minimum drill 0.195mm, track to track 5mil, track to pad 5mil, pad to pad 5mil, via to via 5mil, smd to smd 0mil, copper to edge 10mil, drill to drill 8mil, minimum pad ring 6mil, minimum via ring 4mil, stop-mask expansion 4mil, vias tented up to drill 25mil, thermal gap 7mil
Holes 2.5 mm at 2.25,2.25 2.25,22.75 59.25,22.75 59.25,2.25
tRestrict: area 0,0 to 4.5,4.5; area 0,20.5 to 4.5,25; 18 lines
bRestrict: area 0,0 to 4.5,4.5; area 0,20.5 to 4.5,25; 18 lines

### Footprints (pad centres in the part's own frame; a part is rotated, then mirrored left to right if it is on the bottom)
TP-0.50MM = smd 0.5 x 0.5 bottom: X 0,0
0805-R2013X50N = smd 0.95 x 1.45: 1 -1,0; 2 1,0
0402-1005X55N = smd 0.62 x 0.62: 1 -0.45,0; 2 0.45,0
0603-1608X90N = smd 0.95 x 1: 1 -0.8,0; 2 0.8,0
SOT190P230X110-4N = smd 1 x 1: 1 -1.15,0.75 | smd 1 x 0.6: 2 -1.15,-0.95; 3 1.15,-0.95; 4 1.15,0.95
SODFL1008X40N-882D = smd 0.65 x 0.6: A 0.475,0; C -0.475,0
TP-1.00MM = smd 1 x 1 bottom: X 0,0
LEDC1608X80N-AK = smd 0.9 x 0.95: A 0.8,0; C -0.8,0
FD-1-1.5 = smd 1.016 x 1.016: P$1 0,0
ZX62-AB-5PA = smd 0.4 x 1.35: 1 -1.3,3.025; 2 -0.65,3.025; 3 0,3.025; 4 0.65,3.025; 5 1.3,3.025 | smd 2.1 x 1.6: 6 3.1,2.9; 11 -3.1,2.9 | smd 1.8 x 1.9: 7 4,0.35; 10 -4,0.35 | smd 1.9 x 1.9: 8 1.2,0.35; 9 -1.2,0.35
2X3_SMT = smd 1.143 x 3.683: 1 -2.54,-2.223; 2 -2.54,2.223; 3 0,-2.223; 4 0,2.223; 5 2.54,-2.223; 6 2.54,2.223
1X14_SMD_TH = drill 1: 1 0,0; 2 2.54,0; 3 5.08,0; 4 7.62,0; 5 10.16,0; 6 12.7,0; 7 15.24,0; 8 17.78,0; 9 20.32,0; 10 22.86,0; 11 25.4,0; 12 27.94,0; 13 30.48,0; 14 33.02,0
U.FL-R-SMT-1(60) = smd 1.05 x 2.2: GND1 -1.475,0; GND2 1.475,0 | smd 1.05 x 1: SIG 0,-1.6
0603-1608X90N@1 = smd 0.95 x 1: 1 -0.8,0; 2 0.8,0
ATAB8520E = smd 1.4 x 0.8: 1 8,-7.05; 2 8,-5.78; 3 8,-4.51; 4 8,-3.24; 5 8,-1.97; 6 8,-0.7; 7 8,0.57; 8 8,1.84; 9 8,3.11; 10 8,4.38; 11 8,5.65; 12 8,6.92; 13 8,8.19; 22 -8,8.19; 23 -8,6.92; 24 -8,5.65; 25 -8,4.38; 26 -8,3.11; 27 -8,1.84; 28 -8,0.57; 29 -8,-0.7; 30 -8,-1.97; 31 -8,-3.24; 32 -8,-4.51; 33 -8,-5.78; 34 -8,-7.05 | smd 0.8 x 1.4: 14 4.44,13; 15 3.18,13; 16 1.91,13; 17 0.64,13; 18 -0.63,13; 19 -1.9,13; 20 -3.17,13; 21 -4.44,13; 35 1.73,-13; 36 3,-13; 37 4.27,-13
C&K_PTS820_NO_HOLES = smd 1.15 x 0.75: 1 -1.575,1.525; 2 -1.575,-1.525; 3 1.575,1.525; 4 1.575,-1.525 | smd 0.95 x 1.4: 5 -2.075,0; 6 2.075,0
PWR_SC70 = smd 0.69 x 0.4: D1 1.04,0.65; D2 -1.04,-0.65; G1 -1.04,0; G2 1.04,0; S1 -1.04,0.65; S2 1.04,-0.65 | smd 1 x 0.7: D1' 0,0.525; D2' 0,-0.525
SOTFL50P160X78-3 = smd 0.5 x 0.66: D 0,0.57; G -0.5,-0.57; S 0.5,-0.57
QFN50P700X700X90-49XN-EPSQ515 = smd 0.65 x 0.28: 1 -3.525,2.75; 2 -3.525,2.25; 3 -3.525,1.75; 4 -3.525,1.25; 5 -3.525,0.75; 6 -3.525,0.25; 7 -3.525,-0.25; 8 -3.525,-0.75; 9 -3.525,-1.25; 10 -3.525,-1.75; 11 -3.525,-2.25; 12 -3.525,-2.75; 25 3.525,-2.75; 26 3.525,-2.25; 27 3.525,-1.75; 28 3.525,-1.25; 29 3.525,-0.75; 30 3.525,-0.25; 31 3.525,0.25; 32 3.525,0.75; 33 3.525,1.25; 34 3.525,1.75; 35 3.525,2.25; 36 3.525,2.75 | smd 0.28 x 0.65: 13 -2.75,-3.525; 14 -2.25,-3.525; 15 -1.75,-3.525; 16 -1.25,-3.525; 17 -0.75,-3.525; 18 -0.25,-3.525; 19 0.25,-3.525; 20 0.75,-3.525; 21 1.25,-3.525; 22 1.75,-3.525; 23 2.25,-3.525; 24 2.75,-3.525; 37 2.75,3.525; 38 2.25,3.525; 39 1.75,3.525; 40 1.25,3.525; 41 0.75,3.525; 42 0.25,3.525; 43 -0.25,3.525; 44 -0.75,3.525; 45 -1.25,3.525; 46 -1.75,3.525; 47 -2.25,3.525; 48 -2.75,3.525 | smd 5 x 5: 49 0,0
SOT89-3L = smd 0.9 x 1.3: 1 -1.5,0; 3 1.5,0 | smd 0.9 x 1.9: 2 0,0.3 | smd 1.7 x 2.7: TH 0,2.6
SCREW2 = drill 1.3 long: GND 1.27,0; V+ -1.27,0
ABS07 = smd 1.1 x 1.9: 1 -1.25,0; 2 1.25,0

### Placement (x,y rotation side)
3V1  14.9,9.7 0 bottom
3V2  20.2,9 0 bottom
3V3  14,3.8 0 bottom
3V4  20.2,21.2 0 bottom
5V  8.7,18.3 0 bottom
C1  1.95,5.85 0 top
C2  6.35,18.95 90 top
C3  13.3,7.53 270 top
C4  26.76,9.67 180 top
C5  26.76,10.73 180 top
C6  3.8,17.5 180 top
C7  21.07,4.75 90 top
C8  4.28,5.85 90 top
C9  22.62,4.3 0 top
C10  59.64,17.1 90 top
C11  30,19.43 180 top
C12  61.04,17.1 90 top
C13  27.27,20.4 180 top
C14  11.7,23.2 90 top
C15  13.65,15.78 270 top
C17  13.7,18.18 90 top
C37  19.12,1.43 0 top
C38  16.73,21.27 180 top
C39  13.35,10.72 90 top
C40  14.9,10.8 90 top
C42  20.52,7.95 270 top
C43  26.88,15.3 90 top
C44  26.81,13.28 0 top
C45  19,7.55 270 top
C47  17.32,8.18 270 top
D1  7.2,12.8 90 top
D2  5.92,7.97 270 top
D3  5.28,23.57 90 top
D+  8.15,11.65 0 top
D-  8.15,13.95 0 top
DL1  18.8,23.05 90 top
DL2  2.15,18.9 0 top
F1  6.5,15.45 180 top
FD1  27.65,18 90 top
FD2  65.75,22.75 180 top
FD3  65.75,2.25 90 top
FD4  9.5,8.7 0 top
FRAME1  -27.2,3.38 0 top  (outside the outline)
J1  1.15,12.5 270 top
J2  24.85,12.5 0 bottom
J3  22.13,2.34 0 top
J5  55.15,22.66 180 top
J7  63.9,15.7 270 top
L1  6.6,17.1 180 top
L5  29.07,15.14 180 top
M1  45,12.6 90 top
PB1  9.5,8.7 0 top
Q1  6.97,22.68 270 top
Q2  10.62,20.1 0 top
Q3  14.25,20.48 90 top
Q4  9.07,22.43 0 top
Q5  15.5,2 180 top
Q6  15.5,5.1 0 top
Q7  18.4,3.6 90 top
Q8  15.4,23.3 0 top
R1  4.03,7.62 180 top
R2  25.8,6.42 90 top
R3  15.25,8.18 270 top
R4  27.82,7.3 90 top
R5  26.8,7.28 90 top
R6  16.02,6.65 180 top
R7  17.45,22.95 270 top
R8  5.28,5.85 270 top
R9  5.38,2.9 270 top
R10  13.3,5.5 270 top
R11  13.5,2.3 90 top
R12  18.6,5.3 180 top
R13  20.05,3.48 90 top
R14  30,8.8 180 top
R15  27.15,4.9 180 top
R21  21.55,20.15 90 top
R22  22.55,20.15 90 top
R23  12.65,21.2 270 top
R24  12.72,23.2 270 top
R25  4.8,18.62 180 top
R26  10.65,23.2 90 top
R27  9.07,24.12 180 top
R28  8.6,20.3 90 top
R29  4.53,20.23 0 top
R30  60.26,15.56 0 top
R33  13.8,23.2 270 top
REG_OUT  15.3,0.6 0 bottom
TP3  16.5,7.95 0 top
TP4  14.1,7.96 0 top
U1  19.5,14.35 180 top
U2  12.35,16.23 90 top
U$5  [MH_RND_F_2.2MM_NM]  2.25,2.25 90 top
U$6  [MH_RND_F_2.2MM_NM]  2.25,22.75 90 top
U$7  [MH_RND_F_2.2MM_NM]  59.25,22.75 90 top
U$8  [MH_RND_F_2.2MM_NM]  59.25,2.25 90 top
USB_ID  5.7,11.65 0 top
VANA  28.3,16.3 0 bottom
VRF  28.45,4.9 0 bottom
VUSB  5.7,13.95 0 top
X1  9.5,3 0 top
Y1  24.42,9.44 270 top

### Tracks (layer width: path | path; a pad name or v marks a point on that pad's centre or on a via)
+3V3  (via drill 0.2)
  Top 0.25: 3V3.X 15.35,3.8 v15.5,3.65 | 3V1.X C40.1 | 3V2.X 20.2,8.72 C42.1 | 20.8,21.12 20.27,21.12 3V4.X 20.2,21.15 v19.73,20.68
  Top 0.254: 20.25,10.45 U1.44 20.25,9.78 20.15,9.68 20.15,9.55 v19.6,9 19.6,8.4 | 20.25,18.1 U1.17 20.23,18.32 20.07,18.5 20.07,18.75 19.73,19.12 v19.73,20.68 19.73,23.68 19.55,23.85 DL1.A | U1.36 v15.97,11.22 15.82,11.07 15.82,10.88 15.3,10.35 C40.1 14.43,9.88 C39.1 | C42.1 19.6,8.4 | 19.6,8.4 C45.1 | C38.1 17.48,21.27 v17.75,21.45 | J5.12 26.73,22.18 26.25,22.18 24.68,20.6 R22.2 R21.2 21.32,20.6 20.8,21.12 | R14.2 28.9,8.8 28.4,8.3 27.9,8.3 v27.4,8.8
  Top 0.305: Q5.D2 15.62,2.65 Q5.D2' | Q6.D2 15.38,4.45 Q6.D2' | L5.1 29.87,16.22 v30.68,17.02
  Top 0.406: R15.2 26.7,5.4 v27.05,5.75
  Top 0.61: v27.4,8.8 27.4,7.75 27.35,7.72 | Q5.D2' v15.5,3.65 Q6.D2' | C13.1 30.57,20.4 | 30.57,20.4 31.4,20.4 v31.85,19.95 | C11.1 30.45,20.27 30.57,20.4 | R5.2 27.35,7.72 | 27.35,7.72 27.8,7.72 R4.2 | C37.1 v18.27,0.68 | M1.12 38.08,20.02 v38.75,19.35 | M1.23 38.08,4.72 v38,4.8
  POWER 0.254: 19.48,19.27 19.73,19.52 v19.73,20.68 19.73,21.62 19.52,21.82 18.02,21.82 v17.75,21.45 | v15.97,11.22 15.2,11.6 15.15,11.55 | v19.6,9 19.6,9.12 19.55,9.18
  POWER 0.305: v30.68,17.02 30.62,17.2 30.65,17.23
  POWER 0.406: v27.05,5.75 27.05,6.2 27.3,6.45 27.3,8.7 v27.4,8.8
  POWER 0.61: v18.27,0.68 18.62,0.88 18.7,0.8 | 39.2,19.27 v38.75,19.35 38.83,19.27 | v38,4.8 44.3,4.8 44.8,5.3
  Bottom 0.254: v27.4,8.8 27.4,10.27 J2.1
  pour POWER: 52.5,21.35 28.4,21.35 28.4,24.9 26,24.9 26,19.6 15,19.6 15,12.5 12,12.5 12,7.65 10.25,7.65 10.25,0.05 20.6,0.05 20.6,14.5 24.5,14.5 24.5,12 26.85,12 26.85,8.47 27.72,8.47 27.72,12 40.1,12 40.1,7.5 43.75,7.5 43.75,4.25 25.65,4.25 25.65,3.65 52.5,3.65
+5V  (via drill 0.2)
  Top 0.25: 5V.X 8.7,17.55 v8.82,17.43
  Top 0.254: U2.TH U2.2
  Top 0.305: Q2.D2 10.5,19.45 Q2.D2' | Q1.D2 6.33,22.8 Q1.D2'
  Top 0.61: R29.2 v4.97,20.85 5.45,21.32 5.45,22 6.12,22.68 Q1.D2' | U2.TH 10.51,16.23 10.79,16.51 10.79,17.23 v10.61,17.43 10.62,17.45 Q2.D2' | 10.62,17.43 10.62,17.4 | 8.75,16.4 8.7,16.4 8.7,17.3 v8.82,17.43 | C15.1 U2.2
  Top 0.813: v8.82,17.43 v10.61,17.43 10.62,17.43
  other vias: 9.34,17.43 9.97,17.43
  pour POWER: 23.5,25 23.5,20.1 14.5,20.1 14.5,13 11.5,13 11.5,8.15 0,8.15 0,20.5 4.5,20.5 4.5,25
GND  (via drill 0.2)
  Top 0.254: U1.18 19.75,14.6 U1.49 19.25,14.1 U1.42 | U1.35 15.53,12.1 15.38,11.95 15.28,11.95 15.25,11.93 | C3.2 R10.1
  Top 0.305: Q7.S 18.97,5.22 R12.1
  Top 0.406: J1.5 4.83,11.2 v5.12,10.9
  Top 0.61: M1.35 58.93,14.23 59,14.3
  other vias: 36,4.6 43.15,5.95 56.75,11.63 56.75,9.09 56.75,6.55 56.75,14.05 58.02,7.82 66.91,9.09 60.56,5.28 58.02,5.28 63.1,5.28 65.64,5.28 66.91,5.28 58.02,10.36 58.02,12.9 55.48,5.28 55.48,7.82 55.48,10.36 55.48,12.9 35.73,7.9 28.98,14 29.93,17.4 16.82,12.1 22,11.82 10.95,14.65 19.98,5.28 20,0.62 12.85,18.6 14.9,21.88 13.8,24.15 2.38,17.82 43.12,19.32 36.77,19.48 17.6,6.94 49.55,17.63 48.12,18.55 45.88,19.35 48.92,19.12 59.29,9.09 60.56,10.36 65.64,10.36 54.21,6.55 54.21,9.09 54.21,11.63 54.21,14.17 54.21,16.71 54.21,19.25 55.48,17.98 55.48,15.44 56.75,19.25 58.02,17.98 60.36,18.38 63.1,18.38 65.64,17.98 59.29,19.25 61.83,19.25 64.37,19.25 66.91,19.25 66.91,16.71 66.91,14.17 52.94,5.28 52.94,7.82 52.94,10.36 52.94,12.9 52.94,15.44 52.94,17.98 59.29,14.17 60.56,12.9 60.56,14.17 63.1,12.9 65.64,12.9 59.29,11.63 61.83,11.63 64.37,11.63 66.91,11.63 63.1,10.36 61.83,9.09 64.37,9.09 65.64,7.82 63.1,7.82 60.56,7.82 59.29,6.55 61.83,6.55 64.37,6.55 66.91,6.55 56.75,16.59 51.67,6.55 51.67,9.09 51.67,11.63 51.67,14.17 51.67,16.71 50.4,7.82 50.4,10.36 50.4,12.9 50.4,15.44 47.86,7.82 49.13,9.09 47.86,10.36 49.13,11.63 47.86,12.9 49.13,14.17 46.59,9.09 46.59,11.63 29.69,6.15
  pour Bottom: 52.85,20 67.6,20 67.6,5 52.85,5
  pour Top: -1,25 53,25 53,0 -1,0
  pour Bottom: -1,25 53,25 53,0 -1,0
  pour Top (isolate 0.1): 52.88,20 67.6,20 67.6,5 52.88,5
  pour LFSignals: 0,4.5 0,20.55 4.45,20.55 4.45,25 20.8,25 20.8,21 28.1,21 28.1,25 31.3,25 31.3,21.4 53.52,21.4 53.52,5 53.52,3.6 20.8,3.6 20.8,0 4.5,0 4.5,4.5
N1  (via drill 0.2)
  Top 0.305: Q5.S2 13.6,2.65 R11.2
  Top 0.406: Q5.S1 17.25,1.35 v17.3,1.4 | v14.5,3.2 14.5,2.69 Q5.S2
  Bottom 0.406: v17.3,1.4 14.6,1.4 14.5,1.5 v14.5,3.2
N2  (via drill 0.2)
  Top 0.305: 13.65,2 R11.1 | Q5.G1 16.9,2 17.2,2.3 17.2,3.2 | 17.2,3.2 17.2,3.5 17.3,3.6 Q7.D | 13.65,2 v12.75,2 | v16.55,3.2 17.2,3.2 | 13.65,2 Q5.G2
  POWER 0.305: v12.75,2 15.35,2 v16.55,3.2
N3  (via drill 0.2)
  Top 0.305: v18.1,2.7 18.57,2.7 Q7.G 19.05,3.02 R13.1 | R12.2 v18.15,6.75
  Bottom 0.305: v18.1,2.7 18.85,2.7 18.95,2.8 18.95,5.95 v18.15,6.75
N17650912  (via drill 0.2)
  Top 0.25: v6.8,14.1 6.4,14.1 D1.4
  Top 0.254: J1.1 4.55,13.8 4.65,13.9
  Top 0.61: 6,13.95 D1.4 6.2,13.9 5.75,13.9 | 4.65,13.9 5.45,13.9 | 5.45,13.9 5.75,13.9 | VUSB.X 5.75,13.9 | F1.2 5.65,14.1 5.45,13.9
  Bottom 0.25: VUSB.X 6.65,13.95 v6.8,14.1
N17658775
  Top 0.254: PB1.6 15.18,8.7 R3.1
N17690335  (via drill 0.2)
  Top 0.305: Q1.S2 v6.33,21.05 | R27.2 v7.97,24.12 7.62,23.77 Q1.S1
  Bottom 0.305: v6.33,21.05 6.9,21.05 7.45,21.6 9.55,21.6 9.88,21.93 9.88,23.9 9.68,24.1 8,24.1 v7.97,24.12
N17690346  (via drill 0.2)
  Top 0.254: D3.A 5.28,24.4 5.38,24.5 6.88,24.5 v6.97,24.4
  Top 0.305: R27.1 9.53,23.45 Q4.D 8.71,23 v8.5,23.2 | 7,21.61 Q1.G2 6.97,20.68 v6.85,20.55 | Q1.G1 v6.97,24.4
  POWER 0.305: v6.97,24.4 8.18,23.2 v8.5,23.2 8.5,21.73 8.25,21.48 7.6,21.48 6.85,20.73 v6.85,20.55
N17690381  (via drill 0.2, 0.3)
  Top 0.254: R25.1 5.28,18.62 5.28,18.93 v4.83,19.38 | v10.62,24.15 10.62,23.68 R26.2 | Q4.G 8.57,21.9 v9,22.32
  POWER 0.254: v9,22.32 9.95,22.32 10.62,23 v10.62,24.15
  Bottom 0.254: v4.83,19.38 5.67,20.23 5.67,21.4 6.4,22.12 8.8,22.12 v9,22.32
N17690821  (via drill 0.2)
  Top 0.305: Q2.S1 R28.2 v7.58,20.75 | Q2.S2 12.25,19.45 v12.4,19.3
  Bottom 0.305: v12.4,19.3 7.75,19.3 7.4,19.55 7.4,20.57 v7.58,20.75
N17690840  (via drill 0.2)
  Top 0.254: v12.9,19.95 13.15,19.95 Q3.D
  Top 0.305: Q2.G1 9.05,20.1 8.8,19.85 R28.1 8.5,19.95 v7.9,19.95 | Q2.G2 12.07,20.1 12.22,19.95 v12.9,19.95 | R26.1 10.65,22.07 10.75,21.98 11.32,21.98 v11.38,21.93
  Bottom 0.305: v7.9,19.95 v12.9,19.95 11.38,21.48 v11.38,21.93
N17690878  (via drill 0.2)
  Top 0.254: C14.1 R24.2 12.65,22.68 R23.1 13,22 v13.25,22 | Q3.G v14.82,19.38
  Bottom 0.254: v14.82,19.38 14.82,20.43 v13.25,22
N17834267
  Top 0.305: 2.95,19.15 DL2.A 4.08,20.02 R29.1
N17852357
  Top 0.25: L5.2 28.27,16.27 VANA.X
  Top 0.305: C43.1 27.98,14.85 L5.2 | U1.6 24.73,14.1 25.48,14.85 C43.1 | C44.1 25.98,13.28 26.88,14.18 C43.1
N$1
  Top 0.61: 6.5,11.6 D1.1 6.45,11.3 4.88,9.72 4.33,9.72 J1.6 2.35,9.4 J1.7 | J1.7 J1.8 J1.9 J1.10 2.35,15.6 J1.11 | J1.7 1.46,7.53 | 1.46,7.53 1.46,7.4 0.95,6.89 C1.1 | R1.2 1.56,7.62 1.46,7.53
N$2
  Top 0.61: F1.1 7.35,17.05 L1.1 7.4,17.65 6.55,18.5 C2.1
N$3
  Top 0.254: DL1.C 17.7,22.25 R7.2
N$4  (via drill 0.2)
  Top 0.254: v24.8,7.1 24.8,6.5 25.32,5.97 R2.1
  Bottom 0.254: v24.8,7.1 24.8,10.23 J2.3
N$6
  Top 0.254: Q8.D 16.98,23.87 R7.1
N$7  (via drill 0.2)
  Top 0.25: VRF.X R15.1
  Top 0.406: M1.3 M1.4 48.24,19.74 45.8,17.3 45.8,8.2 47.05,6.95 v48.25,6.95 | R15.1 27.7,5.05 v27.7,5.75
  Top 0.61: M1.32 M1.31 48.24,5.76 v48.25,6.95
  POWER 0.406: v34.9,4.2 35.1,4 45.3,4 v48.25,6.95
  Bottom 0.406: v27.7,5.75 27.7,5.8 28.25,6.35 28.85,6.35 29.45,6.95 29.45,7.9 30.25,8.7 32.25,8.7 34.9,6.05 v34.9,4.2
N$8  (via drill 0.2)
  Top 0.254: v13.45,17.18 13.45,17.48 C17.1 | R10.2 13.3,4.6 v13.5,4.4
  Top 0.305: Q6.G1 13.55,5.1 R10.2 | v13.5,0.9 13.6,0.8 14.3,0.8 14.46,0.96 Q5.D1 15.38,1.35 Q5.D1' 15.3,1.27 REG_OUT.X | Q6.G2 17.2,5.1 v17.3,5.2 | R13.2 v20.05,4.55
  Top 0.61: C17.1 U2.3
  Bottom 0.254: v13.45,17.18 13.7,16.93 13.7,11.6 13.1,11 13.1,5.8 14,4.9
  Bottom 0.305: v17.3,5.2 17.1,5 14.1,5 14,4.9 v13.5,4.4 13.3,4.2 13.3,1.1 v13.5,0.9 | v20.05,4.55 20.05,2.5 19.68,2.12 17.98,2.12 17.5,2.6 17.5,5 v17.3,5.2 | 17.27,5.17 v17.3,5.2
N$12  (via drill 0.2)
  Top 0.254: Q6.S1 14.46,5.86 14.5,5.9 v14.5,6.4
  Top 0.305: Q6.S2 16.95,4.45 17,4.4
  Top 0.61: 17,4.4 18.1,4.4 v18.18,4.5 | v14.5,6.4 14.5,6
  Bottom 0.61: v18.18,4.5 18.18,5.4 17.18,6.4 v14.5,6.4
N$17
  Top 0.406: R30.2 61.2,15.56 | 61.2,15.56 62.3,15.56 J7.SIG | C12.1 61.04,15.96 61.05,15.95 61.05,15.71 61.2,15.56
N$38
  Top 0.406: M1.36 59.81,15.6 R30.1 59.64,15.73 C10.1
N$46
  Top 0.254: U1.43 19.75,10.25 19.5,10 19.5,9.65 19.15,9.35 19.12,9.32 18.02,9.32 C47.1
PA00_XIN32
  Top 0.254: U1.1 23.02,11.4 22.88,11.25 22.88,8.5 23.12,8.25 24.16,8.25 Y1.2 24.54,8.51
  Top 0.305: 24.54,8.51 25.71,8.51 26.31,9.11 C4.2
PA01_XOUT32
  Top 0.254: U1.2 23.4,12.1 24.12,11.38 24.12,10.79 Y1.1
  Top 0.305: C5.2 24.26,10.73 Y1.1
PA02_AIN0  (via drill 0.2)
  Top 0.254: 23.48,12.6 U1.3 23.77,12.6 23.93,12.75 v23.93,12.99
  POWER 0.254: J3.2 24.27,2.74 24.27,7.78 23.98,8.07 23.98,12.93 v23.93,12.99
PA03_VREFA  (via drill 0.2)
  Top 0.254: U1.4 23.38,13.1 v23.88,13.6
  Top 0.305: C7.1 C9.1 22.14,4.26 J3.1
  POWER 0.254: v23.88,13.6 23.32,13.6 22.98,13.25 22.98,3.18 J3.1
PA04_AIN4  (via drill 0.2)
  Top 0.254: U1.9 23.88,15.6 24.7,16.43 24.7,17.2 25.1,17.6 v25.57,17.6
  LFSignals 0.254: v25.57,17.6 27.95,17.6 32.08,13.47 v32.08,6.38
  Bottom 0.254: v32.08,6.38 32.08,2.56 J3.5
PA05_AIN5  (via drill 0.2)
  Top 0.254: U1.10 23.68,16.1 24.25,16.68 24.25,17.4 v25.02,18.18
  LFSignals 0.254: v25.02,18.18 28.12,18.18 32.88,13.43 v32.88,6.38
  Bottom 0.254: 34.88,2.38 J3.6 32.88,4.3 v32.88,6.38
PA06_AIN6  (via drill 0.2)
  Top 0.254: 23.95,18 v24.15,18.2 23.73,17.77 23.73,16.85 23.48,16.6 U1.11 23.38,16.6
  Bottom 0.254: v24.15,18.2 24.85,18.9 26.4,18.9 37.38,7.92 J3.7
PA07_AIN7  (via drill 0.2)
  Top 0.254: U1.12 23.02,18.12 v23.1,18.25
  Bottom 0.254: 39.95,2.38 J3.8 39.91,6.43 26.85,19.5 24.35,19.5 v23.1,18.25
PA08_S0_I2C_SDA  (via drill 0.2)
  Top 0.254: v23.45,20.05 23.1,19.7 R22.1 22.4,19.55 22.4,18.27 22.25,18.12 U1.13
  Bottom 0.254: v23.45,20.05 30.75,20.05 31.55,19.25 32.5,19.25 33.35,20.1 39.9,20.1 J5.6
PA09_S0_I2C_SCL  (via drill 0.2)
  Top 0.254: 21.75,19.5 R21.1 | R21.1 20.85,19.7 20.6,19.95 v20.6,20.6 | 21.82,19.43 R21.1 | 21.75,18.15 21.75,18.32 21.85,18.43 21.85,19.4 R21.1
  Top 0.305: 21.75,18.15 U1.14
  Bottom 0.254: J5.7 39.95,22.62 39.95,21.4 39.25,20.7 20.7,20.7 v20.6,20.6
PA10_TCC0-W2  (via drill 0.2)
  Top 0.254: U1.15 21.25,18.75 v21.2,18.85
  LFSignals 0.254: v21.2,18.85 32.95,18.85 47.55,4.25 47.55,2.35 J3.11
PA11_TCC0-W3  (via drill 0.2)
  Top 0.254: U1.16 20.75,18.45 20.57,18.62 20.57,19.12 v20.32,19.38 20.5,19.2
  LFSignals 0.254: 20.3,19.4 v20.32,19.38 20.35,19.4 20.35,19.45 33.2,19.45 50.08,2.58 J3.12
PA12_MOSI  (via drill 0.2)
  Top 0.254: v30,13.5 29.95,13.25 29.3,13.25 28.95,12.9 28.95,11.15 29.4,10.7 M1.19 | U1.21 18.25,19.35 18,19.6 17.15,19.6 16.7,20.05 v16.2,20.05
  LFSignals 0.254: v16.2,20.05 16.7,20.05 21.07,15.68 26.62,15.68 28.8,13.5 v30,13.5
PA13_SCK  (via drill 0.2)
  Top 0.254: U1.22 17.75,19.05 17.7,19.1 16.55,19.1 v16.4,19.25 | v29.55,12.65 30.23,11.97 M1.18
  LFSignals 0.254: v29.55,12.65 28.98,12.65 26.35,15.28 20.38,15.28 v16.4,19.25
PA14_RF_SSN  (via drill 0.2)
  Top 0.254: v15.55,19.2 15.6,19.2 16.2,18.6 17.15,18.6 17.25,18.5 U1.23 | v28.9,8.15 v30.55,8.15 | v30.55,8.15 M1.21 | v30.55,8.15 30.55,8.7 R14.1
  LFSignals 0.254: v28.9,8.15 28.9,9.05 29.45,9.6 29.45,11.55 26.12,14.88 19.88,14.88 v15.55,19.2 15.6,19.2
  Bottom 0.254: 30.6,8.1 v30.55,8.15
PA15_MISO  (via drill 0.2)
  Top 0.254: U1.24 15.93,17.88 v15.55,18.25 | v28.88,9.85 29.3,9.43 M1.20
  LFSignals 0.254: v15.55,18.25 19.32,14.47 25.88,14.47 28.85,11.5 28.85,9.88 v28.88,9.85
PA16_S1_MOSI  (via drill 0.2)
  Top 0.254: U1.25 15.2,17.1 v14.8,17.5
  LFSignals 0.254: v14.8,17.5 15.2,17.1 16.15,17.1 19.18,14.07 25.52,14.07 v28.38,11.22
  POWER 0.254: v28.38,11.22 v39.5,11.22
  Bottom 0.254: 50.17,22.12 50.17,22.56 J5.3 | v39.5,11.22 39.95,11.22 50.08,21.35 J5.3 | J5.3
PA17_S1_SCK  (via drill 0.2)
  Top 0.254: U1.26 14.8,16.6 v14.62,16.77
  LFSignals 0.254: v14.62,16.77 14.8,16.6 16.07,16.6 19,13.68 22.57,13.68 25.7,10.55 28.27,10.55 v28.38,10.65
  POWER 0.254: v39,10.65 v28.38,10.65
  Bottom 0.254: J5.4 47.55,22.64 47.55,20.07 39,11.53 v39,10.65
PA18_USB_ID  (via drill 0.2)
  Top 0.254: U1.27 v14.97,16.1 | 5.92,7.12 6,7.12 | 6,7.12 6.58,7.12 v6.72,7.28 | D2.A 5.92,7.2 6,7.12
  LFSignals 0.254: v14.97,16.1 14.9,16.1 6.72,7.92 v6.72,7.28
PA19_S1_MISO  (via drill 0.2)
  Top 0.254: U1.28 v15.2,15.6
  LFSignals 0.254: v15.2,15.6 16.52,15.6 18.82,13.3 18.82,13.28 22.4,13.28 25.52,10.15 28,10.15 28.07,10.07 v28.38,10.07
  POWER 0.254: v28.38,10.07 28.38,9.68 28.7,9.35 29.15,9.35 29.9,10.1 v38.48,10.1
  Bottom 0.254: v38.48,10.1 38.48,12.5 45.1,19.12 45.1,22.55 J5.5
PA20_TCC0-W6  (via drill 0.2)
  Top 0.254: R33.2 14.3,22.75 | 14.3,22.75 14.88,22.75 Q8.G | v14.35,22.2 14.35,22.7 14.3,22.75 | U1.29 v14.95,15.1
  LFSignals 0.254: v14.95,15.1 16.43,15.1 18.65,12.88 22.23,12.88 25.35,9.75 27.48,9.75 v28.32,8.9
  POWER 0.254: v39.5,9.53 30.05,9.53 29.4,8.88 28.35,8.88 v28.32,8.9
  Bottom 0.254: v14.95,15.1 14.68,15.1 14.12,15.65 14.12,19.98 12.45,21.65 12.45,22.15 12.82,22.52 14.03,22.52 v14.35,22.2 | v39.5,9.53 42.58,9.53 51.5,18.45 51.5,19.5 53.1,21.1 54.77,21.1 55.15,21.48 J5.1
PA21_TCC0-W7  (via drill 0.2)
  Top 0.254: U1.30 14.53,14.6 v14.43,14.7
  LFSignals 0.254: v14.43,14.7 14.53,14.6 16.35,14.6 18.48,12.47 22.05,12.47 25.23,9.3 26.05,9.3 27.77,7.58 v28.48,7.58
  POWER 0.254: v39,9 30.5,9 29.07,7.58 v28.48,7.58
  Bottom 0.254: v39,9 39.05,9 38.95,9.1 38.95,9.75 39.65,10.45 41.23,10.45 52.7,21.93 52.7,22.57 J5.2
PA22_TC4-W0  (via drill 0.2)
  Top 0.254: U1.31 14.3,14.1 v14.25,14.15
  LFSignals 0.254: v14.25,14.15 14.28,14.15 14.32,14.1 16.3,14.1 18.32,12.07 21.05,12.07 24.38,8.75 25.95,8.75 27.55,7.17 27.8,6.92 v28.48,6.92
  POWER 0.254: v40.62,6.22 33.58,6.22 33.15,5.8 31.93,5.8 30.8,6.92 v28.48,6.92
  Bottom 0.254: v40.62,6.22 41.17,6.22 42.42,4.97 42.42,2.37 J3.9
PA23_TC4-W1  (via drill 0.2)
  Top 0.254: U1.32 13.28,13.6 v13.2,13.68
  LFSignals 0.254: v13.2,13.68 13.28,13.6 16.25,13.6 18.18,11.68 20.88,11.68 24.2,8.35 25.8,8.35 28.4,5.75 v28.5,5.75
  POWER 0.254: v42.4,6.8 41.25,5.65 33.85,5.65 33.33,5.12 29.12,5.12 v28.5,5.75
  Bottom 0.254: v42.4,6.8 44,6.8 45.02,5.78 45.02,2.37 J3.10
PA27_RF_NRES  (via drill 0.2)
  Top 0.25: 40.9,18.4 41.9,19.4 M1.9
  Top 0.254: U1.39 17.75,10.22 17.55,10.03 17.55,9.75 v17.25,9.45 | 40.9,18.4 34.6,18.4 v33.31,17.11
  LFSignals 0.254: v17.25,9.45 17.25,8.82 21.23,4.85 33.27,4.85 33.9,5.47 33.9,16.52 v33.31,17.11
PA28_RF_PWRON  (via drill 0.2)
  Top 0.25: 38.5,6.3 39.35,5.45 M1.24
  Top 0.254: v23.5,7.3 23.5,7 26.4,4.1 28.55,4.1 31.45,7 37.8,7 38.5,6.3 | U1.41 18.75,10.15 v18.9,10
  Bottom 0.254: v18.9,10 18.9,7.8 19.62,7.08 23.27,7.08 v23.5,7.3
PA30_SWCLK  (via drill 0.2)
  Top 0.254: U1.45 20.75,9.65 v20.7,9.6 | v21.85,5.75 21.55,5.75 21.3,6 21.3,8.3 v21.27,8.32 | 27.85,6.83 R4.1 27.65,6.67 27.65,6.35 27.55,6.25 26.55,6.25 v26.45,6.15
  Bottom 0.254: J2.4 24.9,14.77 24.9,16.7 24.6,17 21.52,17 21.32,16.8 21.32,13.05 20.7,12.43 v20.7,9.6 20.45,9.6 20.32,9.47 20.32,8.55 20.57,8.3 21.25,8.3 v21.27,8.32 | v21.85,5.75 26.05,5.75 v26.45,6.15
PA31_SWDIO  (via drill 0.2)
  Top 0.254: U1.46 21.25,9.95 21.4,9.8 21.4,9.28 v21.18,9.05
  Bottom 0.254: J2.2 27.39,12.69 27.2,12.5 21.43,12.5 21.3,12.38 21.3,9.18 v21.18,9.05
PB02_AIN10
  Top 0.254: J3.3 27.16,2.4 26.6,2.4 26.6,2.45 21.9,7.15 21.9,10.15 21.75,10.3 U1.47
PB03_AIN11
  Top 0.25: J3.4 29.41,2.34
  Top 0.254: U1.48 22.4,10.68 22.4,7.3 26,3.7 28.39,3.7 J3.4
PB08_AIN3  (via drill 0.2)
  Top 0.254: U1.7 24.48,14.6 v26.02,16.15 | v5.35,4.22 5.35,5.33 R8.2 C8.1
  Top 0.305: R9.1 5.35,3.35 v5.35,4.22
  LFSignals 0.254: v26.02,16.15 21.55,16.15 16.95,20.75 14.95,20.75 13.97,19.77 13.97,16.18 5.35,7.55 v5.35,4.22
PB09_RF_EVENT  (via drill 0.2)
  Top 0.254: U1.8 24.15,15.1 v26.1,17.05 | M1.25 40.62,4.88 38.08,7.42 30.18,7.42 v30.1,7.5
  LFSignals 0.254: v26.1,17.05 27.85,17.05 30.6,14.3 30.6,12.38 29.95,11.72 29.95,7.65 v30.1,7.5
PB10_TCC0-W4  (via drill 0.2)
  Top 0.254: U1.19 19.25,20.18 v18.93,20.5
  LFSignals 0.254: v18.93,20.5 19.43,20 22.55,20 23.23,20.68 32.85,20.68 49.6,3.92 51.03,3.92 J3.13
PB11_TCC0-W5  (via drill 0.2)
  Top 0.254: U1.20 18.75,19.5 18.12,20.12 18.12,20.82 v18.57,21.27
  LFSignals 0.254: v18.57,21.27 33.05,21.27 49.65,4.68 52.81,4.68 J3.14
PB22_S5_TX  (via drill 0.2)
  Top 0.254: U1.37 16.4,10.82 15.85,10.28 15.85,9.05 v15.9,9 | v35.17,13.95 v38.2,16.98
  LFSignals 0.254: 35,13.78 v35.17,13.95 34.95,13.72 34.95,5.17 33.77,4 20.85,4 20.5,3.65 19.65,3.65 19,4.3 19,4.5 17.7,5.8 16.88,5.8 16.5,6.15 16.5,8 15.9,8.6 v15.9,9 | v38.2,16.98 38.17,16.98 34.85,20.3 34.85,22.64 J5.9
PB23_S5_RX  (via drill 0.2)
  Top 0.254: 17.25,10.47 U1.38 17.25,10.32 17.02,10.1 16.75,10.1 16.6,9.95 v16.6,9.15 | v34.6,14.35 v38.1,17.85
  LFSignals 0.254: v16.6,9.15 16.6,8.75 17,8.35 17,6.55 17.25,6.3 17.95,6.3 19.48,4.78 19.48,4.42 19.82,4.08 20.32,4.08 20.68,4.42 33.55,4.42 34.42,5.3 34.42,14.18 v34.6,14.35 | v38.1,17.85 38.1,21.93 J5.8
RESET#  (via drill 0.2)
  Top 0.254: J5.10 32.3,21.1 34.4,19 v37.35,19 | R6.2 15.18,6.65 v14.57,7.25
  LFSignals 0.254: v33.25,16.2 33.4,16.05 33.4,5.72 32.95,5.28 21.48,5.28 19.02,7.72 19.02,9.15 19.48,9.6 19.48,10.15 19,10.62 16.32,10.62 14.57,8.88 v14.57,7.25
  Bottom 0.254: v33.25,16.2 34.55,16.2 v37.35,19
RESETN  (via drill 0.2)
  Top 0.254: v25.7,7.8 25.8,7.7 R2.2 26.7,6.88 R5.1 | U1.40 18.25,9.97 v18.1,9.82 | 15.28,7.7 R3.2 | R6.1 16.48,7.2 16.35,7.33 v15.95,7.33 15.65,7.33 R3.2 | C3.1 15,7.97 R3.2
  Bottom 0.254: v25.7,7.8 25.7,6.6 25.6,6.5 19.5,6.5 18.1,7.9 | v18.1,9.82 18.1,7.9 | 18.1,7.9 17.6,7.4 17.2,7.4 16.9,7.1 16.18,7.1 v15.95,7.33
USB_ID  (via drill 0.2)
  Top 0.254: J1.4 5.05,11.85 v5.17,11.97 | D2.C v5.92,9.3 | v4.78,21.68 4.78,22.6 D3.C
  Bottom 0.254: v5.92,9.3 5.92,11.7 5.65,11.97 v5.17,11.97 4.15,13 4.15,20.88 4.78,21.5 v4.78,21.68
  Bottom 0.305: USB_ID.X 5.5,11.65 v5.17,11.97
USB_N  (via drill 0.2)
  Top 0.25: J1.2 8.1,13.15 | 8.1,13.15 8.15,13.2 D-.X v8.8,13.95 | 8.1,13.15 16,13.15 15.97,13.12 U1.33
  Bottom 0.25: v8.8,13.95 8.2,13.9 D-.X
USB_P  (via drill 0.2)
  Top 0.25: J1.3 8.1,12.5 | 8.1,12.5 8.15,12.45 D+.X 8.2,11.7 v8.7,11.7 | 8.1,12.5 15.9,12.5 15.97,12.57 U1.34
  Bottom 0.25: D+.X 8.65,11.65 v8.7,11.7
VBATT  (via drill 0.2)
  Top 0.305: Q6.D1 15.62,5.75 Q6.D1' | R9.2 7.68,2.45 X1.V+
  Top 0.61: Q6.D1' v15.35,5.62
  POWER 0.61: v15.35,5.62 15.22,5.5 9.45,5.5 8.53,4.58 8.53,3.25 8.48,3.25 X1.V+
  Bottom 0.254: v15.35,5.62 14.38,5.62 13.8,6.2 13.8,7.66 TP4.X
VIN  (via drill 0.2)
  Top 0.305: R23.2 Q2.D1 10.75,20.75 Q2.D1'
  Top 0.61: Q2.D1' v10.62,21.23
  POWER 0.61: v10.62,21.23 16.62,21.23 19.65,18.2 21.93,18.2 22.9,19.18 24.15,19.18 24.68,19.7 J5.13 | J5.13
VUSB  (via drill 0.2)
  Top 0.305: 4.25,18.52 R25.2 | Q1.D1 7.62,22.55 Q1.D1'
  Top 0.61: L1.2 v5.4,17.5 C6.1 4.35,17.6 R25.2 | Q1.D1' v7.75,22.68
  POWER 0.61: v7.75,22.68 6.9,22.68 5.62,21.4 5.62,19.1 5.4,18.88 v5.4,17.5

### Text on the board
tNames: X1